# EAGLE design raspberry_pi_v007 (EAGLE 9.6.2)
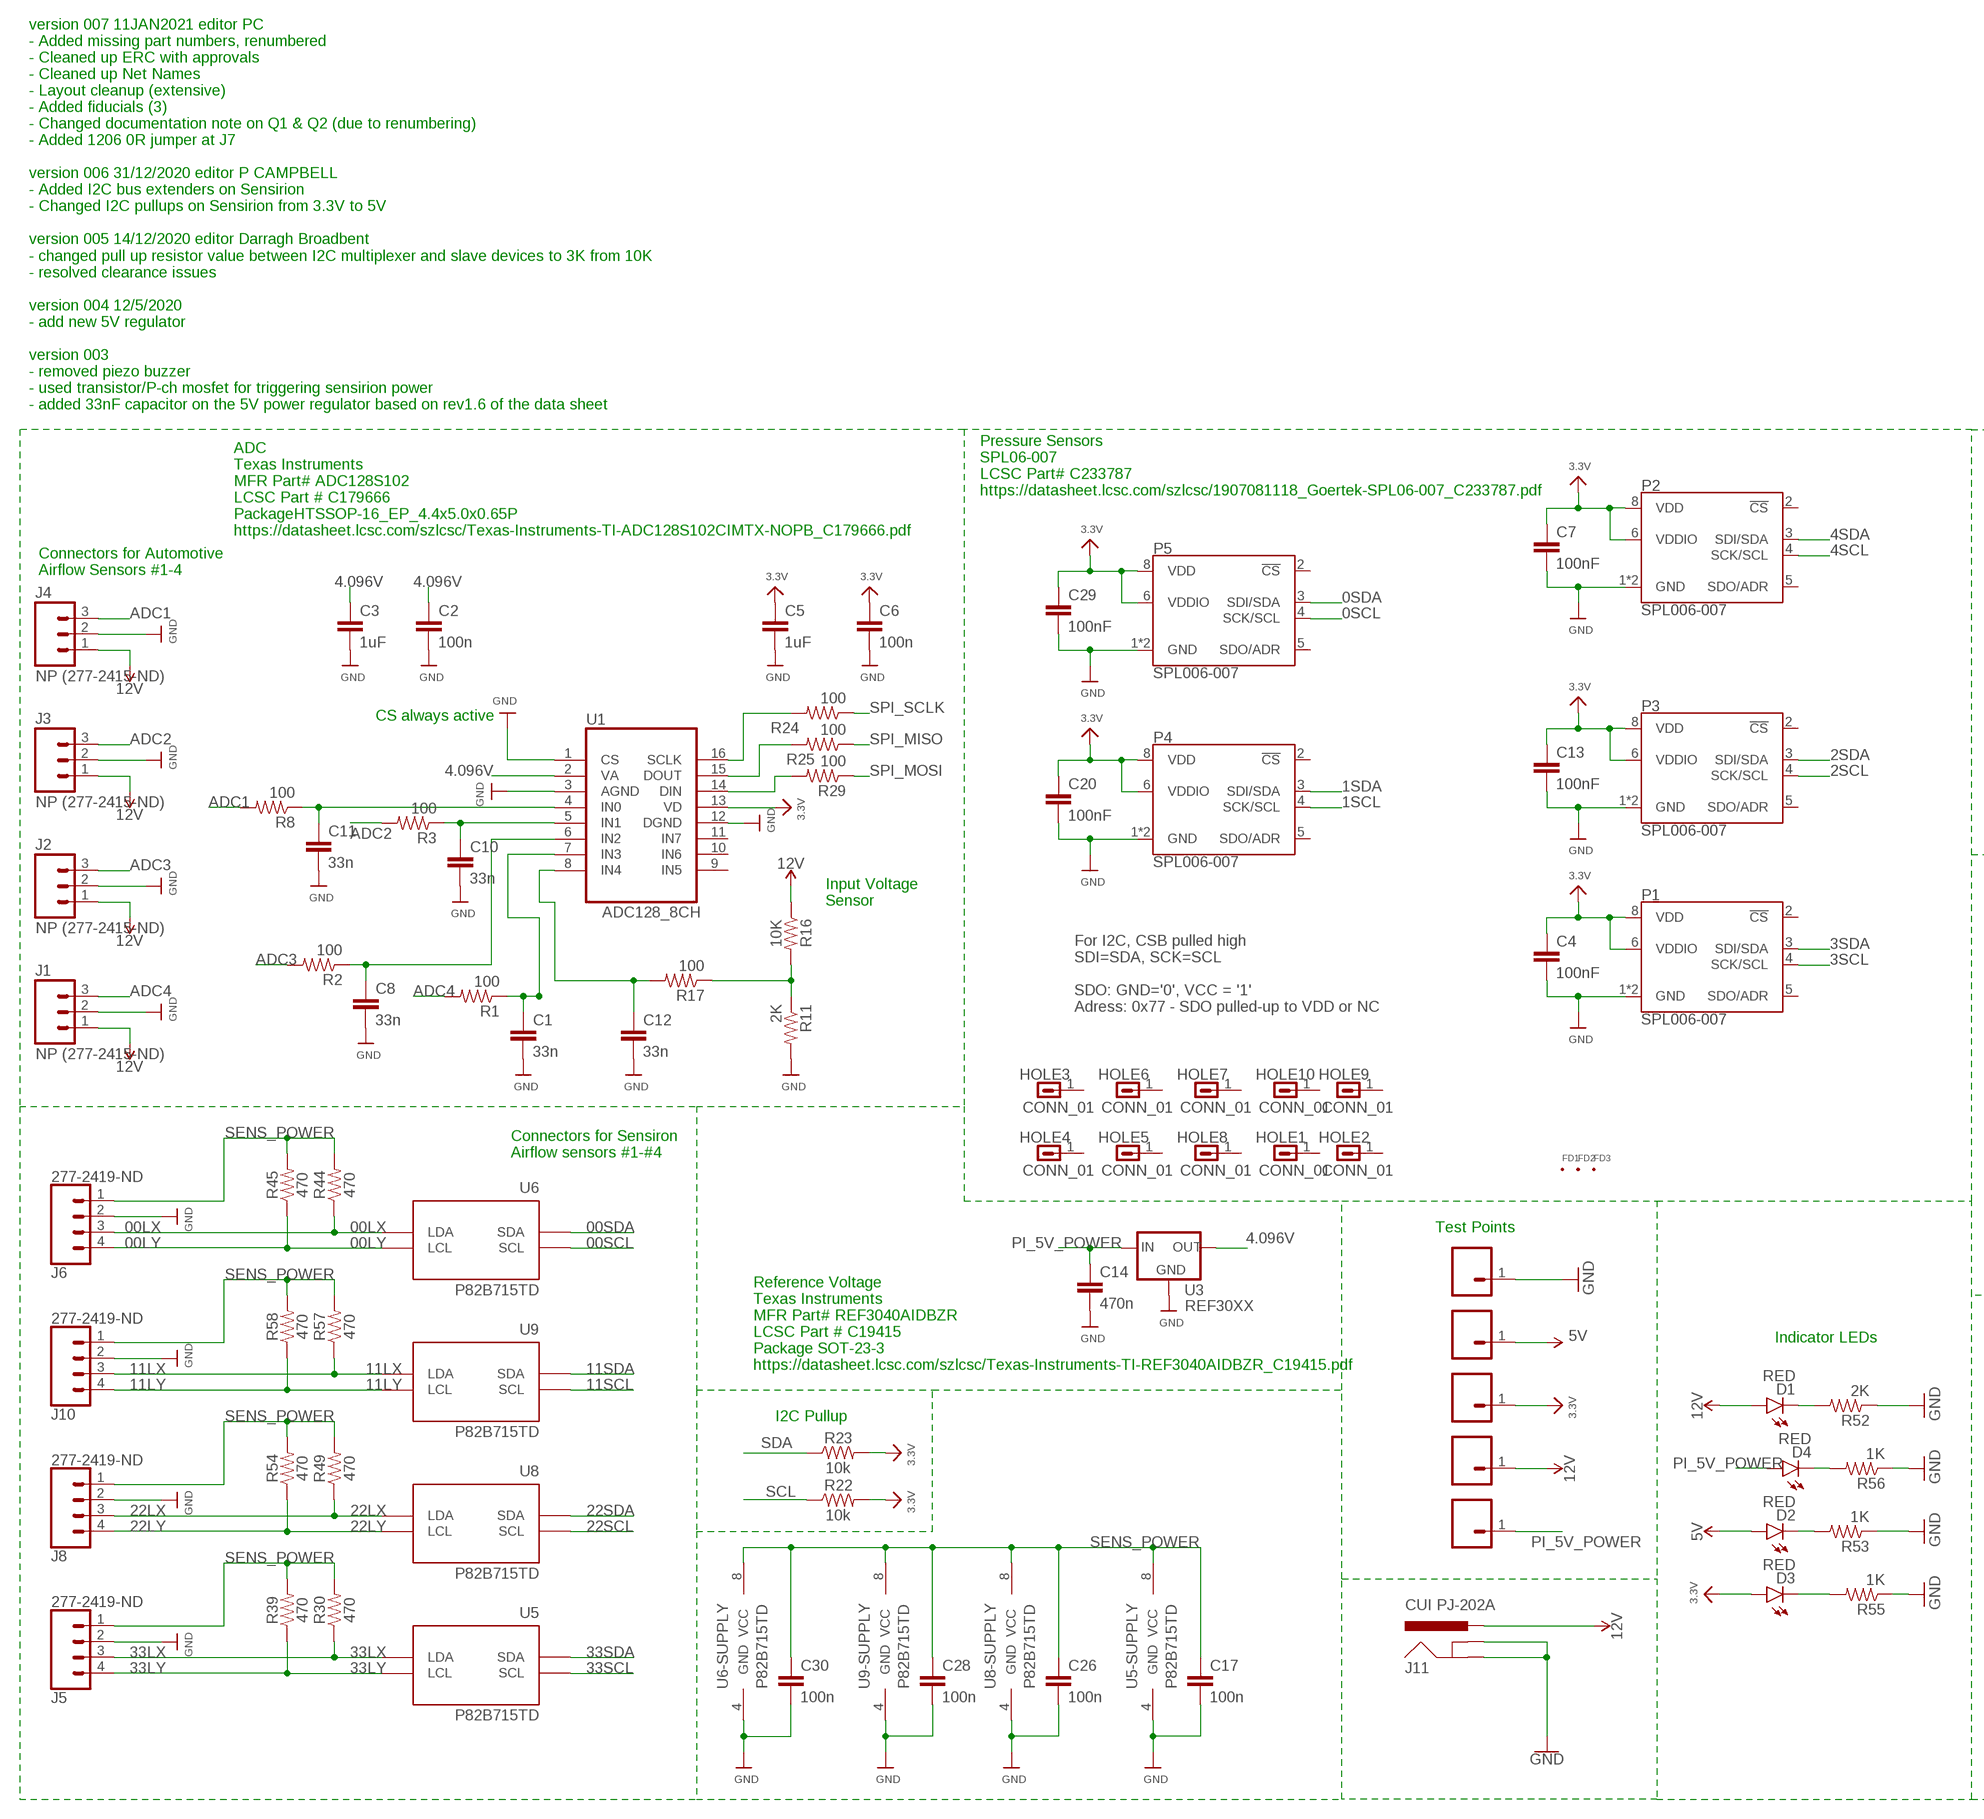
[diagram p0: schematic, sheet 1, part 1 of 2]
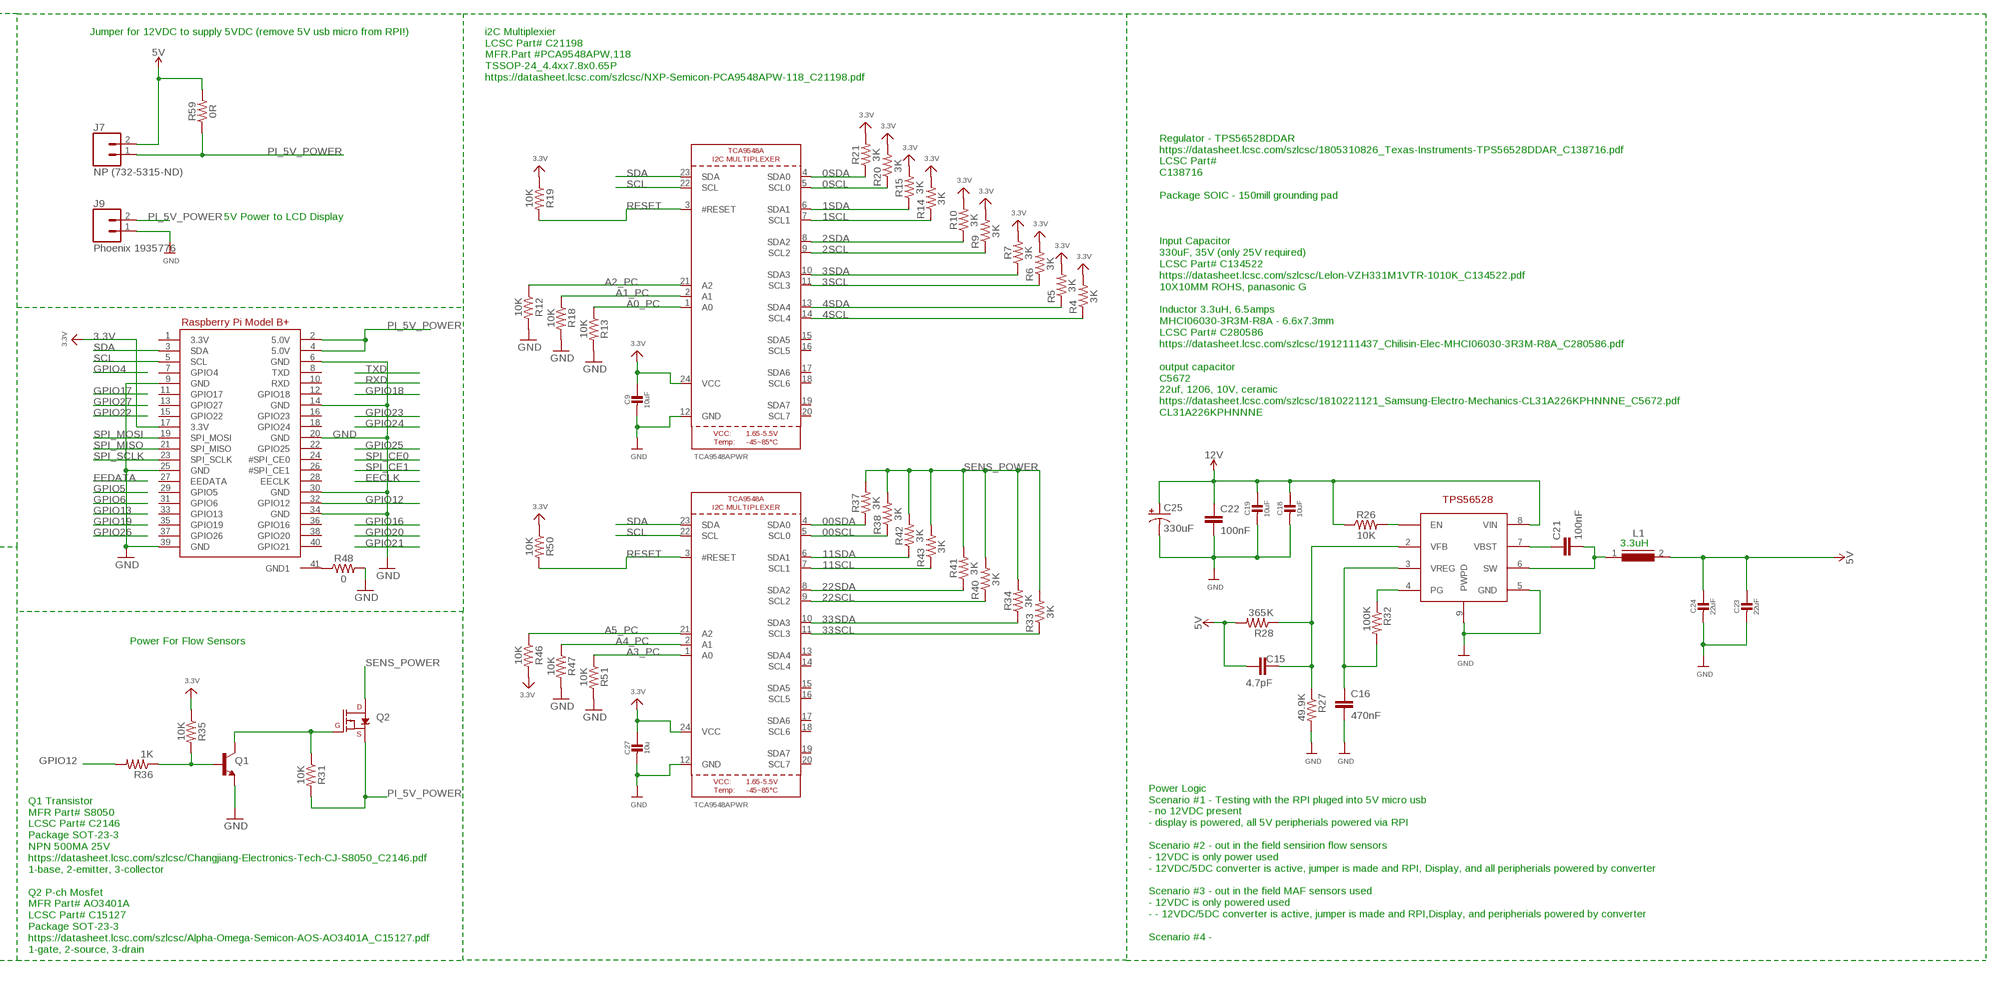
[diagram p1: schematic, sheet 1, part 2 of 2]

## Parts
C1  33n  CAP-0805  [0805]
C2  100n  CAP-0805  [0805]
C3  1uF  CAP-0805  [0805]
C4  100nF  CAP-0805  [0805]
C5  1uF  CAP-0805  [0805]
C6  100n  CAP-0805  [0805]
C7  100nF  CAP-0805  [0805]
C8  33n  CAP-0805  [0805]
C9  10uF  CAP_CERAMIC0805-NOOUTLINE  [0805-NO]
C10  33n  CAP-0805  [0805]
C11  33n  CAP-0805  [0805]
C12  33n  CAP-0805  [0805]
C13  100nF  CAP-0805  [0805]
C14  470n  CAP-0805  [0805]
C15  4.7pF  CAP-0603  [0603]
C16  470nF  CAP-0805  [0805]
C17  100n  CAP-0805  [0805]
C18  10uF  CAP_CERAMIC0805-NOOUTLINE  [0805-NO]
C19  10uF  CAP_CERAMIC0805-NOOUTLINE  [0805-NO]
C20  100nF  CAP-0805  [0805]
C21  100nF  CAP-0805  [0805]
C22  100nF  CAP-0805  [0805]
C23  22uF  CAP_CERAMIC_1206  [_1206]
C24  22uF  CAP_CERAMIC_1206  [_1206]
C25  330uF  560UF-PANASONIC_G-25V-20%  [PANASONIC_G]
C26  100n  CAP-0805  [0805]
C27  10u  CAP_CERAMIC0805-NOOUTLINE  [0805-NO]
C28  100n  CAP-0805  [0805]
C29  100nF  CAP-0805  [0805]
C30  100n  CAP-0805  [0805]
D1  RED  LED-RED1206  [LED-1206]
D2  RED  LED-RED1206  [LED-1206]
D3  RED  LED-RED1206  [LED-1206]
D4  RED  LED-RED1206  [LED-1206]
FD1  FID_40MIL  [FID_040]
FD2  FID_40MIL  [FID_040]
FD3  FID_40MIL  [FID_040]
HOLE1  CONN_01  [1X01-#6_MACHINE]
HOLE2  CONN_01  [1X01-#6_MACHINE]
HOLE3  CONN_01  [1X01-#6_MACHINE]
HOLE4  CONN_01  [1X01-#6_MACHINE]
HOLE5  CONN_01  [1X01-#6_MACHINE]
HOLE6  CONN_01  [1X01-#6_MACHINE]
HOLE7  CONN_01  [1X01-#6_MACHINE]
HOLE8  CONN_01  [1X01-#6_MACHINE]
HOLE9  CONN_01  [1X01-#6_MACHINE]
HOLE10  CONN_01  [1X01-#6_MACHINE]
J1  NP (277-2415-ND)  M03SCREW  [SCREWTERMINAL-3.5MM-3]
J2  NP (277-2415-ND)  M03SCREW  [SCREWTERMINAL-3.5MM-3]
J3  NP (277-2415-ND)  M03SCREW  [SCREWTERMINAL-3.5MM-3]
J4  NP (277-2415-ND)  M03SCREW  [SCREWTERMINAL-3.5MM-3]
J5  277-2419-ND  CONN_043.5MM_RA  [1X04_3.5MM_RA]
J6  277-2419-ND  CONN_043.5MM_RA  [1X04_3.5MM_RA]
J7  NP (732-5315-ND)  CONN_02  [1X02]
J8  277-2419-ND  CONN_043.5MM_RA  [1X04_3.5MM_RA]
J9  Phoenix 1935776  CONN_025MM  [SCREWTERMINAL-5MM-2]
J10  277-2419-ND  CONN_043.5MM_RA  [1X04_3.5MM_RA]
J11  CUI PJ-202A  POWER_JACK  [POWER_JACK_PTH]
L1  INDUCTOR_6.6_7.3  [INDUCTOR_6.6_7.3]
P1  SPL006-007  [LGA-8-2.5X2.0]
P2  SPL006-007  [LGA-8-2.5X2.0]
P3  SPL006-007  [LGA-8-2.5X2.0]
P4  SPL006-007  [LGA-8-2.5X2.0]
P5  SPL006-007  [LGA-8-2.5X2.0]
Q1  500mA/300V  TRANS_NPN-MMBTA42  [SOT23-3]
Q2  4.3A/20V/54mΩ  MOSFET_PCH-IRLML2244  [SOT23-3]
R1  100  RESISTOR0805-RES  [0805]
R2  100  RESISTOR0805-RES  [0805]
R3  100  RESISTOR0805-RES  [0805]
R4  3K  0.3OHM-0805-1/8W-1%  [0805]
R5  3K  0.3OHM-0805-1/8W-1%  [0805]
R6  3K  0.3OHM-0805-1/8W-1%  [0805]
R7  3K  0.3OHM-0805-1/8W-1%  [0805]
R8  100  RESISTOR0805-RES  [0805]
R9  3K  0.3OHM-0805-1/8W-1%  [0805]
R10  3K  0.3OHM-0805-1/8W-1%  [0805]
R11  2K  RESISTOR0805-RES  [0805]
R12  10K  0.3OHM-0805-1/8W-1%  [0805]
R13  10K  0.3OHM-0805-1/8W-1%  [0805]
R14  3K  0.3OHM-0805-1/8W-1%  [0805]
R15  3K  0.3OHM-0805-1/8W-1%  [0805]
R16  10K  0.3OHM-0805-1/8W-1%  [0805]
R17  100  RESISTOR0805-RES  [0805]
R18  10K  0.3OHM-0805-1/8W-1%  [0805]
R19  10K  0.3OHM-0805-1/8W-1%  [0805]
R20  3K  0.3OHM-0805-1/8W-1%  [0805]
R21  3K  0.3OHM-0805-1/8W-1%  [0805]
R22  10k  0.3OHM-0805-1/8W-1%  [0805]
R23  10k  0.3OHM-0805-1/8W-1%  [0805]
R24  100  RESISTOR0805-RES  [0805]
R25  100  RESISTOR0805-RES  [0805]
R26  10K  0.3OHM-0805-1/8W-1%  [0805]
R27  49.9K  RESISTOR0805-RES  [0805]
R28  365K  RESISTOR0805-RES  [0805]
R29  100  RESISTOR0805-RES  [0805]
R30  470  RESISTOR0805  [0805]
R31  10K  0.3OHM-0805-1/8W-1%  [0805]
R32  100K  RESISTOR0805-RES  [0805]
R33  3K  0.3OHM-0805-1/8W-1%  [0805]
R34  3K  0.3OHM-0805-1/8W-1%  [0805]
R35  10K  0.3OHM-0805-1/8W-1%  [0805]
R36  1K  RESISTOR0805-RES  [0805]
R37  3K  0.3OHM-0805-1/8W-1%  [0805]
R38  3K  0.3OHM-0805-1/8W-1%  [0805]
R39  470  RESISTOR0805  [0805]
R40  3K  0.3OHM-0805-1/8W-1%  [0805]
R41  3K  0.3OHM-0805-1/8W-1%  [0805]
R42  3K  0.3OHM-0805-1/8W-1%  [0805]
R43  3K  0.3OHM-0805-1/8W-1%  [0805]
R44  470  RESISTOR0805  [0805]
R45  470  RESISTOR0805  [0805]
R46  10K  0.3OHM-0805-1/8W-1%  [0805]
R47  10K  0.3OHM-0805-1/8W-1%  [0805]
R48  0  0.3OHM-0805-1/8W-1%  [0805]
R49  470  RESISTOR0805  [0805]
R50  10K  0.3OHM-0805-1/8W-1%  [0805]
R51  10K  0.3OHM-0805-1/8W-1%  [0805]
R52  2K  RESISTOR0805-RES  [0805]
R53  1K  RESISTOR0805-RES  [0805]
R54  470  RESISTOR0805  [0805]
R55  1K  RESISTOR0805-RES  [0805]
R56  1K  RESISTOR0805-RES  [0805]
R57  470  RESISTOR0805  [0805]
R58  470  RESISTOR0805  [0805]
R59  0R  RESISTOR1206  [1206]
RPI3B+  MICROBUILDER_RASPBERRYPI_BPLUS_HATSLOTS  [MICROBUILDER_PI_HAT_SLOTS]
TP1  CONN_0138MILL  [1X01-40MILL]
TP2  CONN_0138MILL  [1X01-40MILL]
TP3  CONN_0138MILL  [1X01-40MILL]
TP4  CONN_0138MILL  [1X01-40MILL]
TP5  CONN_0138MILL  [1X01-40MILL]
U1  ADC128_8CH  [TSSOP16]
U2  TCA9548APWR  TCA9548A  [TSSOP24]
U3  REF30XX  [SOT23-3]
U4  TPS56528  [SOIC8_POWER]
U5  P82B715TD  [SOIC-8]
U6  P82B715TD  [SOIC-8]
U7  TCA9548APWR  TCA9548A  [TSSOP24]
U8  P82B715TD  [SOIC-8]
U9  P82B715TD  [SOIC-8]

## Nets
00LX: J6.3 R44.1 U6.7(LDA)
00LY: J6.4 R45.1 U6.2(LCL)
0SCL: P5.4(SCK/SCL) R20.1 U2.5(SCL0)
00SCL: R38.1 U6.3(SCL) U7.5(SCL0)
0SDA: P5.3(SDI/SDA) R21.1 U2.4(SDA0)
00SDA: R37.1 U6.6(SDA) U7.4(SDA0)
1SCL: P4.4(SCK/SCL) R14.1 U2.7(SCL1)
1SDA: P4.3(SDI/SDA) R15.1 U2.6(SDA1)
2SCL: P3.4(SCK/SCL) R9.1 U2.9(SCL2)
2SDA: P3.3(SDI/SDA) R10.1 U2.8(SDA2)
3.3V: C4.1 C5.1 C6.1 C7.1 C9.1 C13.1 C20.1 C27.1 C29.1 D3.A P1.6(VDDIO) P1.8(VDD) P2.6(VDDIO) P2.8(VDD) P3.6(VDDIO) P3.8(VDD) P4.6(VDDIO) P4.8(VDD) P5.6(VDDIO) P5.8(VDD) R4.2 R5.2 R6.2 R7.2 R9.2 R10.2 R14.2 R15.2 R19.1 R20.2 R21.2 R22.2 R23.2 R35.1 R46.2 R50.1 RPI3B+.17(3.3V) TP4.1 U1.13(VD) U2.24(VCC) U7.24(VCC)
3.3V-LED-R: D3.C R55.2
3SCL: P1.4(SCK/SCL) R6.1 U2.11(SCL3)
3SDA: P1.3(SDI/SDA) R7.1 U2.10(SDA3)
4.096V: C2.1 C3.1 U1.2(VA) U3.2(OUT)
4SCL: P2.4(SCK/SCL) R4.1 U2.14(SCL4)
4SDA: P2.3(SDI/SDA) R5.1 U2.13(SDA4)
5V: C15.1 C23.1 C24.1 D2.A J7.2 L1.2 R28.2 R59.2 TP2.1
5V-LED-R: D2.C R53.2
5VREG-EN: R26.2 U4.1(EN)
5VREG-PG: R32.1 U4.4(PG)
5VREG-SW: C21.2 L1.1 U4.6(SW)
5VREG-VBST: C21.1 U4.7(VBST)
5VREG-VFB: C15.2 R27.1 R28.1 U4.2(VFB)
5VREG-VREG: C16.1 R32.2 U4.3(VREG)
11LX: J10.3 R57.1 U9.7(LDA)
11LY: J10.4 R58.1 U9.2(LCL)
11SCL: R43.1 U7.7(SCL1) U9.3(SCL)
11SDA: R42.1 U7.6(SDA1) U9.6(SDA)
12V: C18.1 C19.1 C22.1 C25.+ D1.A J1.1 J2.1 J3.1 J4.1 J11.PWR R16.1 R26.1 TP1.1 U4.8(VIN)
12V-LED-R: D1.C R52.2
22LX: J8.3 R49.1 U8.7(LDA)
22LY: J8.4 R54.1 U8.2(LCL)
22SCL: R40.1 U7.9(SCL2) U8.3(SCL)
22SDA: R41.1 U7.8(SDA2) U8.6(SDA)
33LX: J5.3 R30.1 U5.7(LDA)
33LY: J5.4 R39.1 U5.2(LCL)
33SCL: R33.1 U5.3(SCL) U7.11(SCL3)
33SDA: R34.1 U5.6(SDA) U7.10(SDA3)
A0_PC: R13.1 U2.1(A0)
A1_PC: R18.1 U2.2(A1)
A2_PC: R12.1 U2.21(A2)
A3_PC: R51.1 U7.1(A0)
A4_PC: R47.1 U7.2(A1)
A5_PC: R46.1 U7.21(A2)
ADC1: J4.3 R8.2
ADC2: J3.3 R3.2
ADC3: J2.3 R2.2
ADC4: J1.3 R1.2
ADC-12V-SENSE: R11.1 R16.2 R17.1
ADC-DIN: R29.2 U1.14(DIN)
ADC-DOUT: R25.2 U1.15(DOUT)
ADC-IN0: C11.1 R8.1 U1.4(IN0)
ADC-IN1: C10.1 R3.1 U1.5(IN1)
ADC-IN2: C8.1 R2.1 U1.6(IN2)
ADC-IN3: C1.1 R1.1 U1.7(IN3)
ADC-IN4: C12.1 R17.2 U1.8(IN4)
ADC-SCLK: R24.2 U1.16(SCLK)
GND: C1.2 C2.2 C3.2 C4.2 C5.2 C6.2 C7.2 C8.2 C9.2 C10.2 C11.2 C12.2 C13.2 C14.2 C16.2 C17.2 C18.2 C19.2 C20.2 C22.2 C23.2 C24.2 C25.- C26.2 C27.2 C28.2 C29.2 C30.2 J1.2 J2.2 J3.2 J4.2 J5.2 J6.2 J8.2 J9.1 J10.2 J11.GND J11.GNDBREAK P1.1(GND) P1.7(GND) P2.1(GND) P2.7(GND) P3.1(GND) P3.7(GND) P4.1(GND) P4.7(GND) P5.1(GND) P5.7(GND) Q1.2(E) R11.2 R12.2 R13.2 R18.2 R27.2 R47.2 R48.2 R51.2 R52.1 R53.1 R55.1 R56.1 RPI3B+.6(GND) RPI3B+.9(GND) RPI3B+.14(GND) RPI3B+.20(GND) RPI3B+.25(GND) RPI3B+.30(GND) RPI3B+.34(GND) RPI3B+.39(GND) TP3.1 U1.1(CS) U1.3(AGND) U1.12(DGND) U2.12(GND) U3.3(GND) U4.5(GND) U4.9(PWPD) U5.4(GND) U6.4(GND) U7.12(GND) U8.4(GND) U9.4(GND)
GND1: R48.1 RPI3B+.41(GND1)
GPIO12: R36.2 RPI3B+.32(GPIO12)
PI5V-LED-R: D4.C R56.2
PI_5V_POWER: C14.1 D4.A J7.1 J9.2 Q2.2(S) R31.2 R59.1 RPI3B+.2(5.0V) RPI3B+.4(5.0V) TP5.1 U3.1(IN)
RESET: R19.2 R50.2 U2.3(#RESET) U7.3(#RESET)
SCL: R22.1 RPI3B+.5(SCL) U2.22(SCL) U7.22(SCL)
SDA: R23.1 RPI3B+.3(SDA) U2.23(SDA) U7.23(SDA)
SENS_POWER: C17.1 C26.1 C28.1 C30.1 J5.1 J6.1 J8.1 J10.1 Q2.3(D) R30.2 R33.2 R34.2 R37.2 R38.2 R39.2 R40.2 R41.2 R42.2 R43.2 R44.2 R45.2 R49.2 R54.2 R57.2 R58.2 U5.8(VCC) U6.8(VCC) U8.8(VCC) U9.8(VCC)
SENS_POWER_BASE: Q1.1(B) R35.2 R36.1
SENS_POWER_GATE: Q1.3(C) Q2.1(G) R31.1
SPI_MISO: R25.1 RPI3B+.21(SPI_MISO)
SPI_MOSI: R29.1 RPI3B+.19(SPI_MOSI)
SPI_SCLK: R24.1 RPI3B+.23(SPI_SCLK)
Unconnected: HOLE1.1 HOLE2.1 HOLE3.1 HOLE4.1 HOLE5.1 HOLE6.1 HOLE7.1 HOLE8.1 HOLE9.1 HOLE10.1 P1.2(!CS) P1.5(SDO/ADR) P2.2(!CS) P2.5(SDO/ADR) P3.2(!CS) P3.5(SDO/ADR) P4.2(!CS) P4.5(SDO/ADR) P5.2(!CS) P5.5(SDO/ADR) RPI3B+.1(3.3V) RPI3B+.7(GPIO4) RPI3B+.8(TXD) RPI3B+.10(RXD) RPI3B+.11(GPIO17) RPI3B+.12(GPIO18) RPI3B+.13(GPIO27) RPI3B+.15(GPIO22) RPI3B+.16(GPIO23) RPI3B+.18(GPIO24) RPI3B+.22(GPIO25) RPI3B+.24(#SPI_CE0) RPI3B+.26(#SPI_CE1) RPI3B+.27(EEDATA) RPI3B+.28(EECLK) RPI3B+.29(GPIO5) RPI3B+.31(GPIO6) RPI3B+.33(GPIO13) RPI3B+.35(GPIO19) RPI3B+.36(GPIO16) RPI3B+.37(GPIO26) RPI3B+.38(GPIO20) RPI3B+.40(GPIO21) U1.9(IN5) U1.10(IN6) U1.11(IN7) U2.15(SDA5) U2.16(SCL5) U2.17(SDA6) U2.18(SCL6) U2.19(SDA7) U2.20(SCL7) U7.13(SDA4) U7.14(SCL4) U7.15(SDA5) U7.16(SCL5) U7.17(SDA6) U7.18(SCL6) U7.19(SDA7) U7.20(SCL7)

## Notes on the sheet
- version 007 11JAN2021 editor PC
  - Added missing part numbers, renumbered
  - Cleaned up ERC with approvals
  - Cleaned up Net Names
  - Layout cleanup (extensive)
  - Added fiducials (3)
  - Changed documentation note on Q1 & Q2 (due to renumbering)
  - Added 1206 0R jumper at J7
  
  version 006 31/12/2020 editor P CAMPBELL
  - Added I2C bus extenders on Sensirion
  - Changed I2C pullups on Sensirion from 3.3V to 5V
  
  version 005 14/12/2020 editor Darragh Broadbent
  - changed pull up resistor value between I2C multiplexer and slave devices to 3K from 10K
  - resolved clearance issues
  
  version 004 12/5/2020
  - add new 5V regulator
  
  version 003
  - removed piezo buzzer 
  - used transistor/P-ch mosfet for triggering sensirion power
  - added 33nF capacitor on the 5V power regulator based on rev1.6 of the data sheet
- ADC
  Texas Instruments
  MFR Part# ADC128S102
  LCSC Part # C179666
  PackageHTSSOP-16_EP_4.4x5.0x0.65P
  https://datasheet.lcsc.com/szlcsc/Texas-Instruments-TI-ADC128S102CIMTX-NOPB_C179666.pdf
- Jumper for 12VDC to supply 5VDC (remove 5V usb micro from RPI!)
- Pressure Sensors
  SPL06-007
  LCSC Part# C233787
  https://datasheet.lcsc.com/szlcsc/1907081118_Goertek-SPL06-007_C233787.pdf
- i2C Multiplexier
  LCSC Part# C21198
  MFR.Part #PCA9548APW,118
  TSSOP-24_4.4xx7.8x0.65P
  https://datasheet.lcsc.com/szlcsc/NXP-Semicon-PCA9548APW-118_C21198.pdf
- Connectors for Automotive 
  Airflow Sensors #1-4
- CS always active
- 5V Power to LCD Display
- Input Voltage 
  Sensor
- For I2C, CSB pulled high
  SDI=SDA, SCK=SCL
  
  SDO: GND='0', VCC = '1'
  Adress: 0x77 - SDO pulled-up to VDD or NC
- Regulator - TPS56528DDAR
  https://datasheet.lcsc.com/szlcsc/1805310826_Texas-Instruments-TPS56528DDAR_C138716.pdf
  LCSC Part# 
  C138716
  
  Package SOIC - 150mill grounding pad
  
  
  
  Input Capacitor
  330uF, 35V (only 25V required)
  LCSC Part# C134522
  https://datasheet.lcsc.com/szlcsc/Lelon-VZH331M1VTR-1010K_C134522.pdf
  10X10MM ROHS, panasonic G
  
  Inductor 3.3uH, 6.5amps
  MHCI06030-3R3M-R8A - 6.6x7.3mm
  LCSC Part# C280586
  https://datasheet.lcsc.com/szlcsc/1912111437_Chilisin-Elec-MHCI06030-3R3M-R8A_C280586.pdf
  
  output capacitor
  C5672
  22uf, 1206, 10V, ceramic
  https://datasheet.lcsc.com/szlcsc/1810221121_Samsung-Electro-Mechanics-CL31A226KPHNNNE_C5672.pdf
  CL31A226KPHNNNE
- Connectors for Sensiron
  Airflow sensors #1-#4
- 3.3uH
- Test Points
- Reference Voltage
  Texas Instruments
  MFR Part# REF3040AIDBZR
  LCSC Part # C19415
  Package SOT-23-3
  https://datasheet.lcsc.com/szlcsc/Texas-Instruments-TI-REF3040AIDBZR_C19415.pdf
- Indicator LEDs | Power For Flow Sensors
- I2C Pullup
- Q1 Transistor
  MFR Part# S8050
  LCSC Part# C2146
  Package SOT-23-3
  NPN 500MA 25V
  https://datasheet.lcsc.com/szlcsc/Changjiang-Electronics-Tech-CJ-S8050_C2146.pdf
  1-base, 2-emitter, 3-collector
  
  Q2 P-ch Mosfet
  MFR Part# AO3401A
  LCSC Part# C15127
  Package SOT-23-3
  https://datasheet.lcsc.com/szlcsc/Alpha-Omega-Semicon-AOS-AO3401A_C15127.pdf
  1-gate, 2-source, 3-drain
- Power Logic
  Scenario #1 - Testing with the RPI pluged into 5V micro usb
  - no 12VDC present
  - display is powered, all 5V peripherials powered via RPI
  
  Scenario #2 - out in the field sensirion flow sensors
  - 12VDC is only power used
  - 12VDC/5DC converter is active, jumper is made and RPI, Display, and all peripherials powered by converter
  
  Scenario #3 - out in the field MAF sensors used
  - 12VDC is only powered used
  - - 12VDC/5DC converter is active, jumper is made and RPI,Display, and peripherials powered by converter
  
  Scenario #4 -

## Library data of the parts
C1-C8 C10-C17 C20-C22 C26 C28-C30 = SparkFun-Capacitors:CAP
C9 C18 C19 C23 C24 C27 = microbuilder:CAP_CERAMIC: Ceramic Capacitors For new designs, use the packages preceded by an '_' character since they are more reliable: The following footprints should be used on most boards: _0402 - Standard footprint for regular board layouts _0603 - Standard footprint for regular board layouts _0805 - Standard footprint for regular board layouts _1206 - Standard footprint for regular board layouts For extremely tight-pitch boards where space is at a premium, the following 'micro-pitch' footprints can be used (smaller pads, no silkscreen outline, etc.): _0402MP - Micro-pitch footprint for very dense/compact boards _0603MP - Micro-pitch footprint for very dense/compact boards _0805MP - Micro-pitch footprint for very dense/compact boards _1206MP - Micro-pitch footprint for very dense/compact boards
C25 = SparkFun-Capacitors:560UF: 560µF polarized capacitors A capacitor is a passive two-terminal electrical component used to store electrical energy temporarily in an electric field.; PROD_ID: CAP-09983; VALUE: 560uF
D1-D4 = SparkFun-LED:LED-RED: Red SMD LED Used in manufacturing of most products at SparkFun Packages: 0603 - SMD 0603 package [Product Link] <http://docs.avagotech.com/docs/AV02-0551EN> 0603 SMART - SMD 0603 SMART package ( more efficient and expensive)[Product Link] <http://www.osram-os.com/Graphics/XPic2/00077099_0.pdf> 1206 - SMD1206 package [Product Link] <https://www.sparkfun.com/datasheets/DevTools/LilyPad/Q150OVS4.pdff> SparkFun Products: Pro Mini 328 -5V <https://www.sparkfun.com/products/821> RedBoard <https://www.sparkfun.com/products/12757> IOIO-OTG <https://www.sparkfun.com/products/13613>; PROD_ID: DIO-09912
FD1-FD3 = Fiducial:FID: Fiducial marks. Top and Bottom copper with stop mask
HOLE1-HOLE10 = th_libraries:CONN_01: #6 Machine Screw tite - 144mil hole, 256mil diameter
J1-J4 = SparkFun-Connectors:M03: Header 3 Standard 3-pin 0.1" header. Use with straight break away headers (SKU : PRT-00116), right angle break away headers (PRT-00553), swiss pins (PRT-00743), machine pins (PRT-00117), and female headers (PRT-00115). Molex polarized connector foot print use with SKU : PRT-08232 with associated crimp pins and housings.; PROD_ID: CONN-08288
J5 J6 J8 J10 = th_libraries:CONN_04: Multi connection point. Often used as Generic Header-pin footprint for 0.1 inch spaced/style header connections On any of the 0.1 inch spaced packages, you can populate with these: Break Away Headers - Straight <https://www.sparkfun.com/products/116> (PRT-00116) Break Away Male Headers - Right Angle <https://www.sparkfun.com/products/553> (PRT-00553) Female Headers <https://www.sparkfun.com/products/115> (PRT-00115) Break Away Headers - Machine Pin <https://www.sparkfun.com/products/117> (PRT-00117) Break Away Female Headers - Swiss Machine Pin <https://www.sparkfun.com/products/743> (PRT-00743) For SCREWTERMINALS and SPRING TERMINALS visit here: Screw Terimnals on SparkFun.com <https://www.sparkfun.com/search/results?term=Screw+Terminals> (5mm/3.5mm/2.54mm spacing) This device is also useful as a general connection point to wire up your design to another part of your project. Our various solder wires solder well into these plated through hole pads. Hook-Up Wire - Assortment (Stranded, 22 AWG) <https://www.sparkfun.com/products/11375> (PRT-11375) Hook-Up Wire - Assortment (Solid Core, 22 AWG) <https://www.sparkfun.com/products/11367> (PRT-11367) View the entire wire category on our website here <https://www.sparkfun.com/categories/141> Special notes: Molex polarized connector foot print use with SKU : PRT-08231 with associated crimp pins and housings. 1MM SMD Version SKU: PRT-10208
J7 = SparkFun-Connectors:CONN_02: Multi connection point. Often used as Generic Header-pin footprint for 0.1 inch spaced/style header connections On any of the 0.1 inch spaced packages, you can populate with these: Break Away Headers - Straight <https://www.sparkfun.com/products/116> (PRT-00116) Break Away Male Headers - Right Angle <https://www.sparkfun.com/products/553> (PRT-00553) Female Headers <https://www.sparkfun.com/products/115> (PRT-00115) Break Away Headers - Machine Pin <https://www.sparkfun.com/products/117> (PRT-00117) Break Away Female Headers - Swiss Machine Pin <https://www.sparkfun.com/products/743> (PRT-00743) For SCREWTERMINALS and SPRING TERMINALS visit here: Screw Terimnals on SparkFun.com <https://www.sparkfun.com/search/results?term=Screw+Terminals> (5mm/3.5mm/2.54mm spacing) This device is also useful as a general connection point to wire up your design to another part of your project. Our various solder wires solder well into these plated through hole pads. Hook-Up Wire - Assortment (Stranded, 22 AWG) <https://www.sparkfun.com/products/11375> (PRT-11375) Hook-Up Wire - Assortment (Solid Core, 22 AWG) <https://www.sparkfun.com/products/11367> (PRT-11367) View the entire wire category on our website here <https://www.sparkfun.com/categories/141> Special notes: Molex polarized connector foot print use with: PRT-08233 with associated crimp pins and housings. 2.54_SCREWTERM for use with PRT-10571. 3.5mm Screw Terminal footprints for PRT-08084 5mm Screw Terminal footprints for use with PRT-08432
J9 = SparkFun-Connectors:CONN_02: Multi connection point. Often used as Generic Header-pin footprint for 0.1 inch spaced/style header connections On any of the 0.1 inch spaced packages, you can populate with these: Break Away Headers - Straight <https://www.sparkfun.com/products/116> (PRT-00116) Break Away Male Headers - Right Angle <https://www.sparkfun.com/products/553> (PRT-00553) Female Headers <https://www.sparkfun.com/products/115> (PRT-00115) Break Away Headers - Machine Pin <https://www.sparkfun.com/products/117> (PRT-00117) Break Away Female Headers - Swiss Machine Pin <https://www.sparkfun.com/products/743> (PRT-00743) For SCREWTERMINALS and SPRING TERMINALS visit here: Screw Terimnals on SparkFun.com <https://www.sparkfun.com/search/results?term=Screw+Terminals> (5mm/3.5mm/2.54mm spacing) This device is also useful as a general connection point to wire up your design to another part of your project. Our various solder wires solder well into these plated through hole pads. Hook-Up Wire - Assortment (Stranded, 22 AWG) <https://www.sparkfun.com/products/11375> (PRT-11375) Hook-Up Wire - Assortment (Solid Core, 22 AWG) <https://www.sparkfun.com/products/11367> (PRT-11367) View the entire wire category on our website here <https://www.sparkfun.com/categories/141> Special notes: Molex polarized connector foot print use with: PRT-08233 with associated crimp pins and housings. 2.54_SCREWTERM for use with PRT-10571. 3.5mm Screw Terminal footprints for PRT-08084 5mm Screw Terminal footprints for use with PRT-08432; SF_SKU: PRT-08432
J11 = SparkFun-Connectors:POWER_JACK: Power Jack Connector This is the standard 5.5mm barrel jack for power. The PTH is the most common, proven, reliable, footprint. The Slot footprint only works if the mill layer is transmitted to the PCB fab house so be warned. Here are the connectors we sell at SparkFun: DC Barrel Power Jack/Connector <https://www.sparkfun.com/products/119> (PRT-00119) DC Barrel Power Jack/Connector (SMD) <https://www.sparkfun.com/products/12748> (PRT-12748) DC Barrel Jack Adapter - Breadboard Compatible <https://www.sparkfun.com/products/10811> (PRT-10811) It is used on this SparkFun product (and many, many others): SparkFun RedBoard - Programmed with Arduino <https://www.sparkfun.com/products/12757> (DEV-12757) Also, if you need a mating power supply or connector, please check these out: Wall Adapter Power Supply - 9VDC 650mA <https://www.sparkfun.com/products/298> (TOL-00298) DC Barrel Jack Adapter - Male <https://www.sparkfun.com/products/10287> (PRT-10287); PROD_ID: CONN-08197
L1 = th_libraries:INDUCTOR_6.6_7.3: https://datasheet.lcsc.com/szlcsc/1912111437_Chilisin-Elec-MHCI06030-3R3M-R8A_C280586.pdf 06030 6.6mm x 7.3mm
P1-P5 = th_libraries:SPL006-007: Goertek SPL06-007 – Combined Humidity and Pressure Sensor The SPL06-007 is as combined digital humidity, pressure and temperature sensor.. The sensor module is housed in an extremely compact metal-lid LGA package with a footprint of only 2.5×2.0mm² with a height of 0.95mm. . Datasheet <https://datasheet.lcsc.com/szlcsc/1907081118_Goertek-SPL06-007_C233787.pdf>
Q1 = SparkFun-DiscreteSemi:TRANS_NPN: NPN transistor Current controlled devices typically used to amplify current or used as a switch. BC547 - COM-08928 <http://www.sparkfun.com/products/8928> (TO-92 45V 100mA) (1.Collector 2.Base 3.Emitter) 2N3904 - COM-00521 <http://www.sparkfun.com/products/521> (TO-92 40V 200mA) (1.Emitter 2.Base 3.Collector) P2N2222A - COM-12852 <http://www.sparkfun.com/products/12852> (TO-92 40V 600mA) (1.Collector 2.Base 3.Emitter); PROD_ID: TRANS-09116
Q2 = SparkFun-DiscreteSemi:MOSFET_PCH: P-channel MOSFETs Voltage controlled devices that allow control of high current outputs. SparkFun Products: SparkFun ESP32 Thing <https://www.sparkfun.com/products/13907> SparkFun ESP8266 Thing <https://www.sparkfun.com/products/13231> SparkFun Pi Servo HAT V2 <https://www.sparkfun.com/products/15316> DMG2305UX-7 (20V/4.2A/SOT23-3); PROD_ID: TRANS-11153
R1-R3 R8 R11 R17 R24 R25 R27-R29 R32 R36 R52 R53 R55 R56 = SparkFun-Passives:RESISTOR: Resistor Basic schematic elements and footprints for 0603, 1206, and PTH resistors.
R4-R7 R9 R10 R12-R16 R18-R23 R26 R31 R33-R35 R37 R38 R40-R43 R46-R48 R50 R51 = SparkFun-Resistors:0.3OHM: 0.3Ω resistor A resistor is a passive two-terminal electrical component that implements electrical resistance as a circuit element. Resistors act to reduce current flow, and, at the same time, act to lower voltage levels within circuits. - Wikipedia; PROD_ID: RES-11622; VALUE: 0.3
R30 R39 R44 R45 R49 R54 R57-R59 = SparkFun-Resistors:RESISTOR: Generic Resistor Package
RPI3B+ = pi_hat_with_ground_pin:MICROBUILDER_RASPBERRYPI_BPLUS
TP1-TP5 = th_libraries3:CONN_01: #6 Machine Screw tite - 144mil hole, 256mil diameter
U1 = th_libraries:ADC128_8CH: ADC128S102 12-bit, 8 Channel ADC http://www.ti.com/lit/ds/symlink/adc128s102.pdf?HQS=TI-null-null-digikeymode-df-pf-null-wwe&ts=1591294747607 https://www.digikey.com/product-detail/en/texas-instruments/ADC128S102CIMTX-NOPB/296-41184-1-ND/5222639
U2 U7 = microbuilder:TCA9548A: TCA9548A I2C Multiplexer
U3 = th_libraries:REF30XX: Voltage Reference REF3012 - 1.25V REF3020 - 2.048V REF3025 - 2.5V REF3030 - 3.0V REF3033 - 3.3V REF3040 - 4.096V REF3040AIDBZR https://www.digikey.com/product-detail/en/texas-instruments/REF3040AIDBZR/296-35920-1-ND/4135041
U4 = th_libraries:TPS56528: TPS56528 https://datasheet.lcsc.com/szlcsc/1805310826_Texas-Instruments-TPS56528DDAR_C138716.pdf
U5 U6 U8 U9 = Volks73-NXPSemiconductors:P82B715?: I2C-Bus Extender I2C-bus extender Documentation Datasheet <http://www.nxp.com/documents/data_sheet/P82B715.pdf> General Description The P82B715 is a bipolar IC intended for application in I2C-bus and derivative bus systems. While retaining all the operating modes and features of the I2C-bus it permits extension of the practical separation distance between components on the I2C-bus by buffering both the data (SDA) and the clock (SCL) lines. The I2C-bus capacitance limit of 400 pF restricts practical communication distances to a few meters. Using one P82B715 at each end of a long cable (connecting Lx/Ly to Lx/Ly) reduces that cable’s loading on the linked I2C-buses by a factor of 10 and allows the total system capacitance load (all devices, cable, connectors, and traces or wires connected to the I2C-bus) to be around 3000 pF while the loading on each I2C-bus on the Sx/Sy sides remains below 400 pF. Longer cables or low-cost, general-purpose wiring may be used to link I2C-bus based modules without degrading noise margins. Multiple P82B715s can be connected together, linking their Lx/Ly ports, in a star or multi-point architecture as long as the total capacitance of the system is less than about 3000 pF and each bus at an Sx/Sy connection is well below 400 pF. This configuration, with the master and/or slave devices attached to the Sx/Sy port of each P82B715, has full multi-master communication capability. The P82B715 alone does not support voltage level translation, but it can be simply implemented using low cost transistors when required. There is no restriction on interconnecting the Sx/Sy I/Os, and, because the device output levels are always held within 100 mV of input drive levels, P82B715 is compatible with bus buffers that use voltage level offsets, e.g., PCA9511A, PCA9517, Sx/Sy side of P82B96. The lower VOL level and ability to operate with any master, slave or bus buffer is the primary advantage of the using the P82B715 for long distance buses at the disadvantage of not isolating bus capacitance like the P82B96 or PCA9600 are able to do. The primary disadvantage of the P82B96 and PCA9600 is that the static level offset needed to isolate bus capacitance does not allow these devices to operate with other bus buffers with special offset levels or with master/slaves that require a VIL lower than 0.8 V with noise margin. A proven quick design-in point-to-point/multi-point circuit (Figure 9) is included in Section 8.2 to allow rapid use of the P82B715 along with comparison waveforms so that the designer can clearly see the trade-offs between the P82B715 and the P82B96/PCA9600 and choose the type of device that is best for their application. Features Dual, bidirectional, unity voltage gain buffer with no external directional control required Compatible with I2C-bus and its derivatives SMBus, PMBus, DDC, etc. Logic signal levels may include (but not exceed) both supply and ground Logic signal input voltage levels are output without change and are independent of VCC ×10 impedance transformation, but does not change logic voltage levels Supply voltage range 3 V to 12 V Clock speeds to at least 100 kHz and 400 kHz when other system delays permit ESD protection exceeds 2500 V HBM per Mil. Std 883C-3015.7 and 400 V MM per JESD22-A115 (I/Os have diodes to VCC and GND) Latch-up testing is done to JEDEC Standard JESD78 which exceeds 100 mA Applications Increase the total connected capacitance of an I2C-bus system to around 3000 pF Drive I2C-bus signals over long cables to approximately 50 meters or 3000 pF Drives ×10 lower impedance bus wiring for improved noise immunity Multi-drop distribution of I2C-bus signals using low cost twisted-pair cables AdvancedTCA radial IPMB architecture Driving 30 mA Fm+ devices from standard 3 mA parts; APPLICATIONS: I2C; CAPACITANCE-INPUT: 3000pF; CURRENT_SUPPLY: 22mA; DATA_RATE: 400kHz; DELAY_TIME: -; DESCRIPTION: IC REDRIVER I2C 1CH 400KHZ 8SO; DOCUMENTATION_LINK: <a href="http://www.nxp.com/documents/data_sheet/P82B715.pdf">Datasheet</a>; DOCUMENTATION_URL: http://www.nxp.com/documents/data_sheet/P82B715.pdf; INPUT: 2-Wire Buse; MANUFACTURER: NXP Semiconductors; NUMBER_OF_CHANNELS: 1; OPERATING_TEMPERATURE: -40C ~ 85C; OUTPUT: 2-Wire Bus; PART_NUMBER: P82B715TD,118; SIGNAL_CONDITIONING: -; SUPPLIER_ITEM_LINK: <a href="http://www.digikey.com/product-detail/en/P82B715TD,118/568-1007-2-ND/735621">Details</a>; SUPPLIER_ITEM_NUMBER: 568-1007-2-ND; SUPPLIER_ITEM_URL: http://www.digikey.com/product-detail/en/P82B715TD,118/568-1007-2-ND/735621; SUPPLIER_LINK: <a href="http://www.digikey.com">Home Page</a>; SUPPLIER_NAME: Digi-Key; SUPPLIER_URL: http://www.digikey.com; TYPE: Buffer, ReDriver; VOLTAGE_SUPPLY: 4.5V ~ 12V

## Net classes
1 highpower: width 0.305 mm, drill 0.483 mm
2 lowpower: width 0.305 mm, drill 0.483 mm

## Board
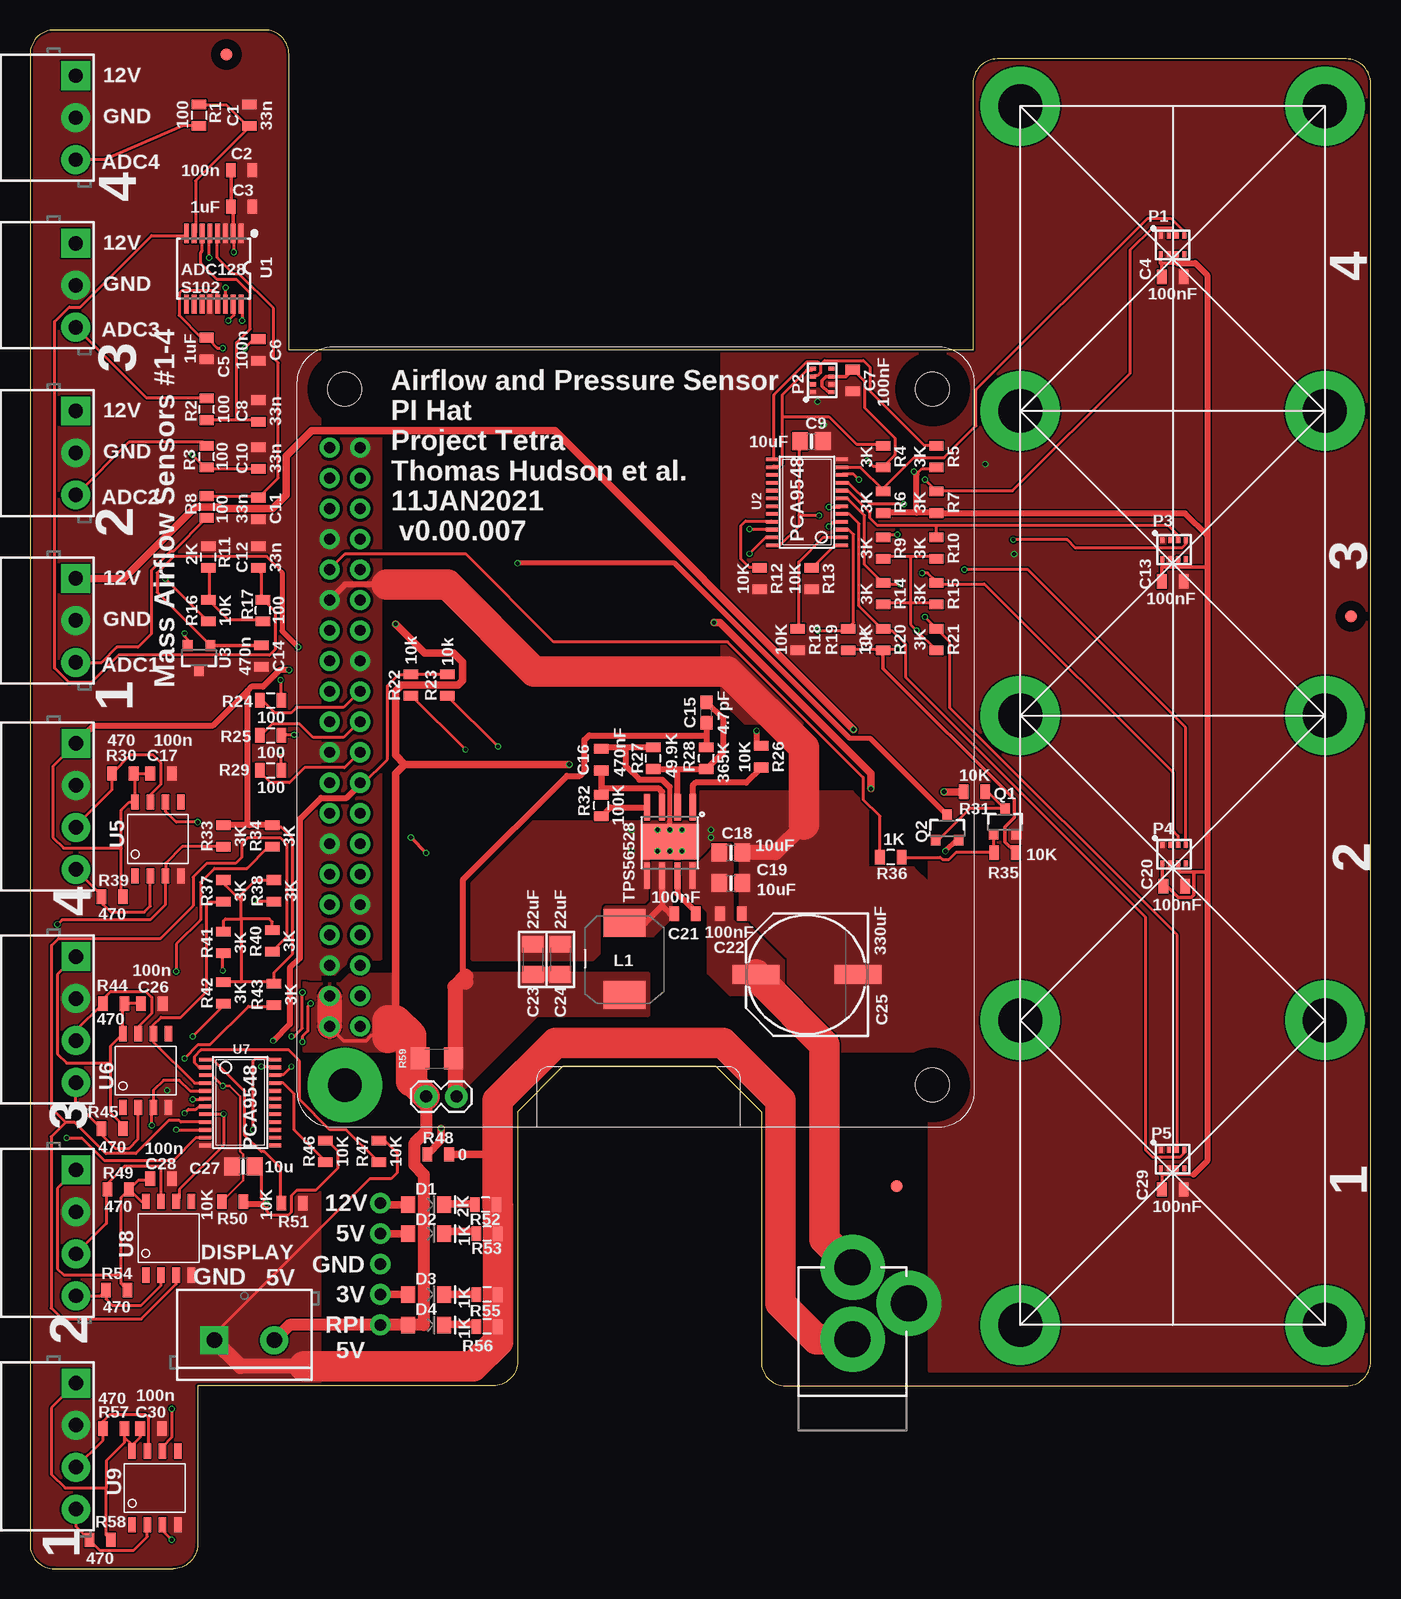
[diagram p2: board, top side]
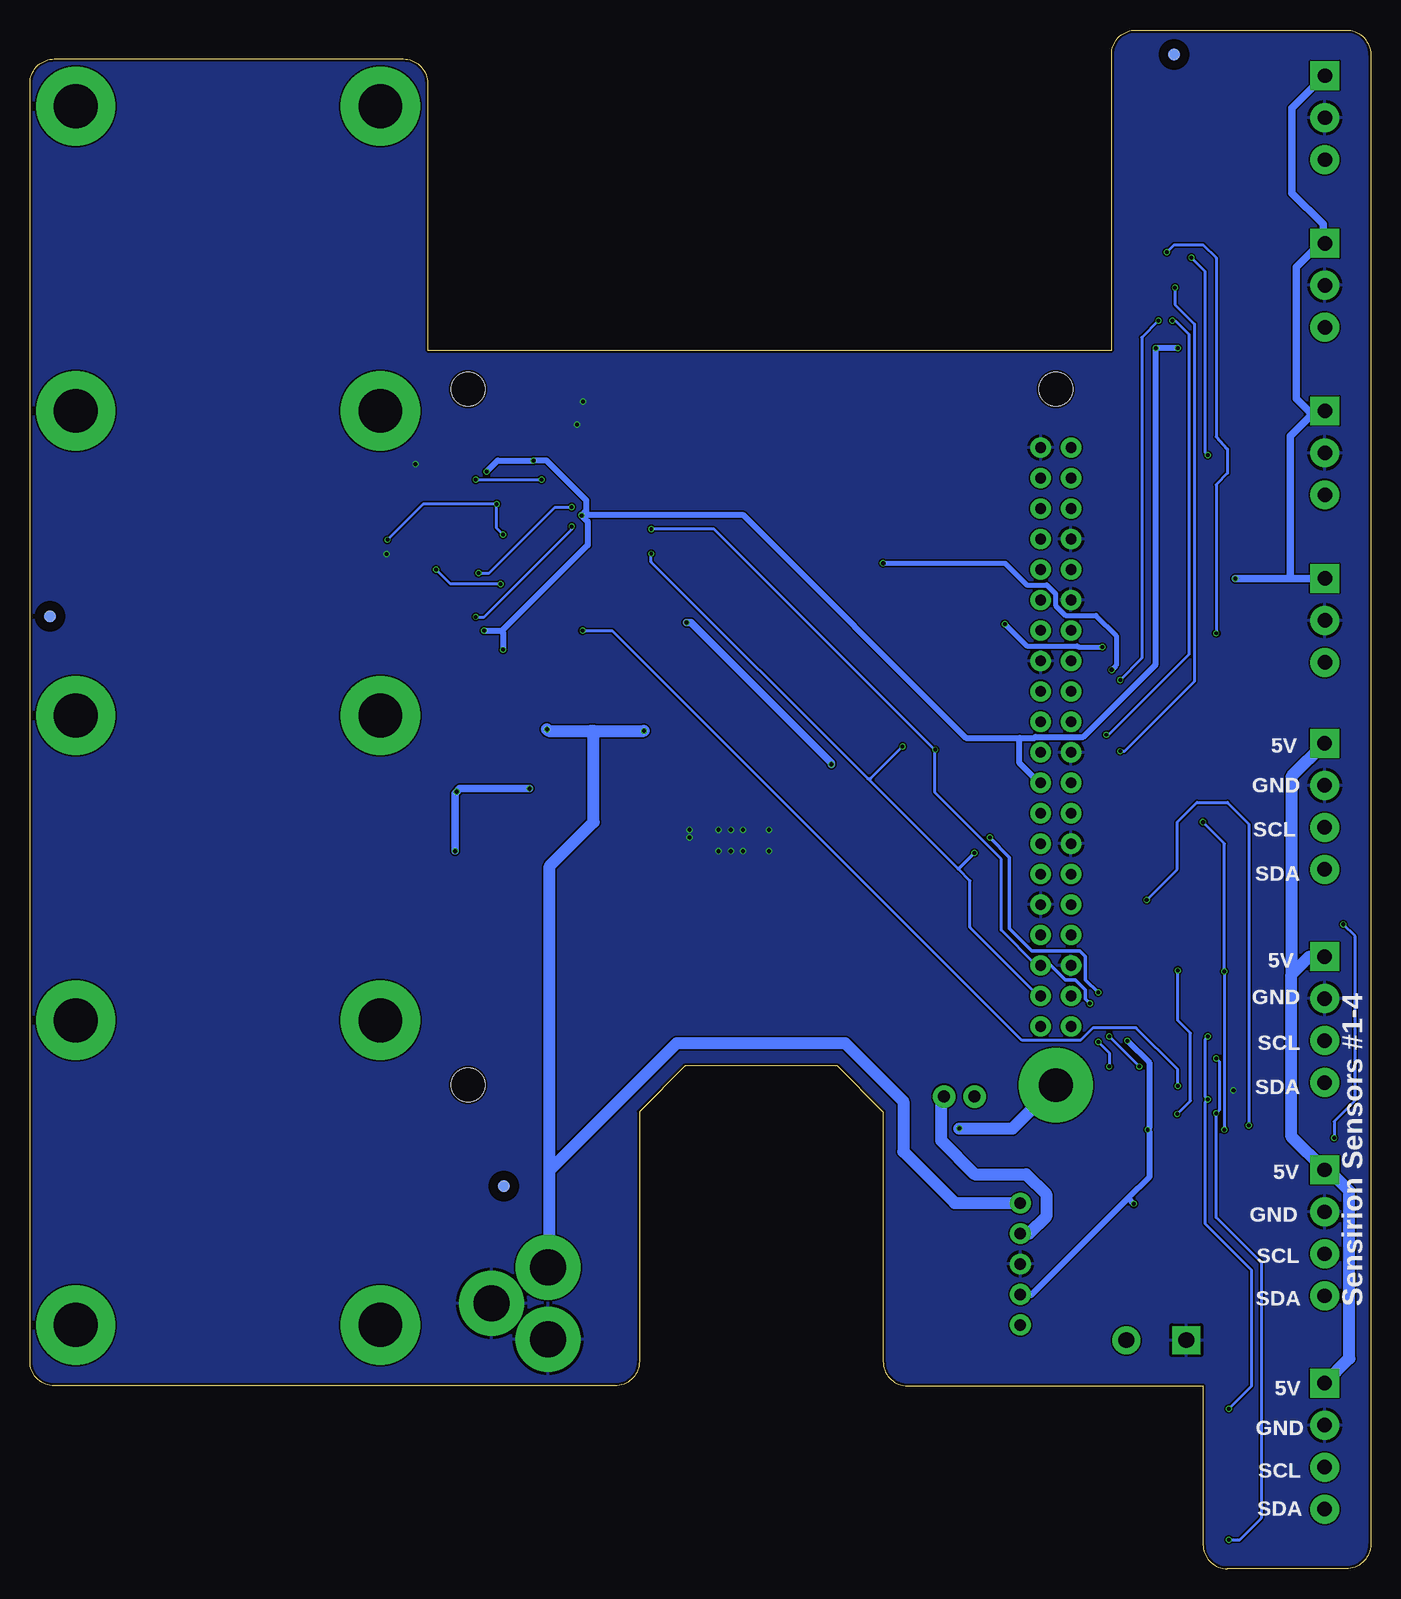
[diagram p3: board, bottom side, seen from below]

Size 111.76 x 128.27 mm. Coordinates in mm from the lower left corner, seen from the top.
Outline: 40.64,38.1 44.45,41.91 57.15,41.91 60.96,38.1 60.96,17.27 arc90 62.99,15.24 109.73,15.24 arc90 111.76,17.27 111.76,123.83 arc90 109.73,125.86 80.64,125.86 arc90 78.61,123.83 78.61,101.6 21.59,101.6 21.59,126.24 arc90 19.56,128.27 2.03,128.27 arc90 0,126.24 0,2.03 arc90 2.03,0 11.94,0 arc90 13.97,2.03 13.97,15.24 38.61,15.24 arc90 40.64,17.27 40.64,38.1
Copper layers (1*16): Top 0.035mm / dielectric 1.6mm / Bottom 0.035mm
Design rules "jlcpcb-2layers": minimum track width 5mil, minimum drill 0.3mm, track to track 5mil, track to pad 5mil, pad to pad 5mil, via to via 5mil, smd to smd 5mil, copper to edge 0.2mm, drill to drill 6mil, minimum pad ring 10mil, minimum via ring 3mil, stop-mask expansion 4mil, vias tented up to drill 0mil, thermal gap 10mil

### Footprints (pad centres in the part's own frame; a part is rotated, then mirrored left to right if it is on the bottom)
0805 = smd 0.8 x 1.2: 1 -0.9,0; 2 0.9,0
0805-NO = smd 1.3 x 1.5: 1 -0.95,0; 2 0.95,0
0603 = smd 1.1 x 1: 1 -0.85,0; 2 0.85,0
_1206 = smd 1.4 x 1.8: 1 -1.27,0; 2 1.27,0
PANASONIC_G = smd 3.9 x 1.6: + 4.25,0; - -4.25,0
LED-1206 = smd 1.2 x 1.4: A -1.5,0; C 1.5,0
FID_040 = smd 1.016 x 1.016 bottom: FIDB 0,0 | smd 1.016 x 1.016: FIDT 0,0
1X01-#6_MACHINE = drill 3.658 pad 6.604: 1 0,0
SCREWTERMINAL-3.5MM-3 = drill 1.2 pad 2.413 square: 1 0,0 | drill 1.2 pad 2.413: 2 3.5,0; 3 7,0
1X04_3.5MM_RA = drill 1.2 pad 2.413 square: 1 -0.228,0.023 | drill 1.2 pad 2.413: 2 3.272,0.023; 3 6.772,0.023; 4 10.272,0.023
1X02 = drill 1.016 pad 1.88: 1 0,0; 2 2.54,0
SCREWTERMINAL-5MM-2 = drill 1.3 pad 2.032 square: 1 0,0 | drill 1.3 pad 2.032: 2 5,0
POWER_JACK_PTH = drill 2.997 pad 4.318: GND 0,7.7; GNDBREAK 4.7,10.7; PWR 0,13.7
INDUCTOR_6.6_7.3 = smd 2.35 x 3.5: 1 -3.025,0.02; 2 2.975,0.02
LGA-8-2.5X2.0 = smd 0.5 x 0.35: 1 0.771,0.975; 2 0.771,0.325; 3 0.771,-0.325; 4 0.771,-0.975; 5 -0.779,-0.975; 6 -0.779,-0.325; 7 -0.779,0.325; 8 -0.779,0.975
SOT23-3 = smd 0.8 x 0.9: 1 -0.95,-1; 2 0.95,-1; 3 0,1.1
1206 = smd 1.6 x 1.8: 1 -1.4,0; 2 1.4,0
MICROBUILDER_PI_HAT_SLOTS = drill 0.9 pad 1.676: 1 8.37,51.23; 2 8.37,53.77; 3 10.91,51.23; 4 10.91,53.77; 5 13.45,51.23; 6 13.45,53.77; 7 15.99,51.23; 8 15.99,53.77; 9 18.53,51.23; 10 18.53,53.77; 11 21.07,51.23; 12 21.07,53.77; 13 23.61,51.23; 14 23.61,53.77; 15 26.15,51.23; 16 26.15,53.77; 17 28.69,51.23; 18 28.69,53.77; 19 31.23,51.23; 20 31.23,53.77; 21 33.77,51.23; 22 33.77,53.77; 23 36.31,51.23; 24 36.31,53.77; 25 38.85,51.23; 26 38.85,53.77; 27 41.39,51.23; 28 41.39,53.77; 29 43.93,51.23; 30 43.93,53.77; 31 46.47,51.23; 32 46.47,53.77; 33 49.01,51.23; 34 49.01,53.77; 35 51.55,51.23; 36 51.55,53.77; 37 54.09,51.23; 38 54.09,53.77; 39 56.63,51.23; 40 56.63,53.77 | drill 2.8 pad 6.198: 41 3.48,52.502 | hole 2.8: 3.5,3.5; 61.5,52.5; 61.5,3.5
1X01-40MILL = drill 0.965 pad 1.397: 1 0,0
TSSOP16 = smd 0.4 x 1.6: 1 -2.225,-2.85; 2 -1.575,-2.85; 3 -0.925,-2.85; 4 -0.275,-2.85; 5 0.375,-2.85; 6 1.025,-2.85; 7 1.675,-2.85; 8 2.325,-2.85; 9 2.325,3.05; 10 1.675,3.05; 11 1.025,3.05; 12 0.375,3.05; 13 -0.275,3.05; 14 -0.925,3.05; 15 -1.575,3.05; 16 -2.225,3.05
TSSOP24 = smd 0.305 x 0.991: 1 -3.575,-2.918; 2 -2.925,-2.918; 3 -2.275,-2.918; 4 -1.625,-2.918; 5 -0.975,-2.918; 6 -0.325,-2.918; 7 0.325,-2.918; 8 0.975,-2.918; 9 1.625,-2.918; 10 2.275,-2.918; 11 2.925,-2.918; 12 3.575,-2.918; 13 3.575,2.918; 14 2.925,2.918; 15 2.275,2.918; 16 1.625,2.918; 17 0.975,2.918; 18 0.325,2.918; 19 -0.325,2.918; 20 -0.975,2.918; 21 -1.625,2.918; 22 -2.275,2.918; 23 -2.925,2.918; 24 -3.575,2.918
SOIC8_POWER = smd 0.533 x 2.2: 1 -1.905,-2.515 | smd 0.61 x 2.21: 2 -0.635,-2.515 | smd 0.498 x 2.2: 3 0.635,-2.515; 4 1.905,-2.515; 5 1.905,3.2; 6 0.635,3.2; 7 -0.635,3.2; 8 -1.905,3.2 | smd 4.902 x 2.946: 9 0,0.356
SOIC-8 = smd 1.27 x 0.635: 1 -3.073,1.905; 2 -3.073,0.635; 3 -3.073,-0.635; 4 -3.073,-1.905; 5 3.073,-1.905; 6 3.073,-0.635; 7 3.073,0.635; 8 3.073,1.905

### Placement (x,y rotation side)
C1  18.29,121.16 90 top
C2  17.65,116.59 0 top
C3  17.65,113.54 0 top
C4  95.25,107.7 0 top
C5  14.73,101.73 270 top
C6  19.05,101.6 270 top
C7  68.58,99.06 270 top
C8  19.05,96.52 90 top
C9  65.15,93.98 0 top
C10  19.05,92.58 90 top
C11  19.05,88.39 270 top
C12  19.05,84.33 90 top
C13  95.25,82.3 0 top
C14  19.3,76.07 270 top
C15  56.39,71.37 90 top
C16  47.62,67.44 90 top
C17  10.92,66.29 0 top
C18  58.42,59.69 0 top
C19  58.42,57.15 0 top
C20  95.38,56.9 0 top
C21  54.61,54.61 180 top
C22  58.42,54.61 0 top
C23  41.91,50.8 90 top
C24  44.2,50.8 90 top
C25  64.77,49.53 180 top
C26  10.16,47.12 0 top
C27  17.78,33.53 180 top
C28  10.92,32.51 0 top
C29  95.25,31.62 0 top
C30  10.08,11.68 0 top
D1  33.02,30.35 0 top
D2  33.02,27.94 0 top
D3  33.02,22.86 0 top
D4  33.02,20.32 0 top
FD1  72.26,31.88 0 top
FD2  110.11,79.38 0 top
FD3  16.38,126.24 0 top
HOLE1  82.55,121.92 90 top
HOLE2  107.95,121.92 90 top
HOLE3  82.55,96.52 90 top
HOLE4  107.95,96.52 90 top
HOLE5  82.55,71.12 90 top
HOLE6  107.95,71.12 90 top
HOLE7  82.55,45.72 90 top
HOLE8  107.95,45.72 90 top
HOLE9  82.55,20.32 90 top
HOLE10  107.95,20.32 90 top
J1  3.81,124.46 270 top
J2  3.81,110.49 270 top
J3  3.81,96.52 270 top
J4  3.81,82.55 270 top
J5  3.81,68.58 270 top
J6  3.81,50.8 270 top
J7  33.02,39.37 0 top
J8  3.81,33.02 270 top
J9  15.37,19.05 0 top
J10  3.81,15.24 270 top
J11  68.58,11.43 0 top
L1  49.53,50.8 270 top
P1  95.25,110.36 90 top
P2  66.04,99.06 180 top
P3  95.38,84.96 90 top
P4  95.38,59.56 90 top
P5  95.25,34.16 90 top
Q1  81.28,62.23 0 top
Q2  76.45,61.72 0 top
R1  14.1,121.16 270 top
R2  14.73,96.65 90 top
R3  14.73,92.71 90 top
R4  71.12,92.71 270 top
R5  75.56,92.71 270 top
R6  71.12,88.9 270 top
R7  75.56,88.9 270 top
R8  14.73,88.52 270 top
R9  71.12,85.09 270 top
R10  75.56,85.09 270 top
R11  14.86,84.33 90 top
R12  60.83,82.55 270 top
R13  65.15,82.55 270 top
R14  71.12,81.28 270 top
R15  75.56,81.28 270 top
R16  14.86,79.88 90 top
R17  19.43,79.88 90 top
R18  64.01,77.47 270 top
R19  68.2,77.47 90 top
R20  71.12,77.47 270 top
R21  75.56,77.47 270 top
R22  31.75,73.66 90 top
R23  34.8,73.66 90 top
R24  20.07,72.39 0 top
R25  20.07,69.47 0 top
R26  60.96,67.69 270 top
R27  51.94,67.56 90 top
R28  56.39,67.56 90 top
R29  20.07,66.55 0 top
R30  7.75,66.29 0 top
R31  78.74,64.77 180 top
R32  47.62,63.63 90 top
R33  16.13,61.09 90 top
R34  20.19,61.09 90 top
R35  81.28,59.69 180 top
R36  71.75,59.31 180 top
R37  16.13,56.52 90 top
R38  20.32,56.52 90 top
R39  6.86,56.01 0 top
R40  20.19,52.32 90 top
R41  16.13,52.2 90 top
R42  16.13,48.01 90 top
R43  20.32,47.88 90 top
R44  6.98,47.12 0 top
R45  6.86,36.7 0 top
R46  24.64,34.8 90 top
R47  29.08,34.8 90 top
R48  34.04,34.54 0 top
R49  7.37,31.62 0 top
R50  16.89,30.61 180 top
R51  21.84,30.48 0 top
R52  37.97,30.35 180 top
R53  38.1,27.94 180 top
R54  7.24,23.24 0 top
R55  38.1,22.86 180 top
R56  38.1,20.19 180 top
R57  6.98,11.68 0 top
R58  5.84,2.41 0 top
R59  33.91,42.55 0 top
RPI3B+  78.74,36.83 90 top
TP1  29.21,30.48 90 top
TP2  29.21,27.94 180 top
TP3  29.21,25.4 90 top
TP4  29.21,22.86 90 top
TP5  29.21,20.32 0 top
U1  15.37,108.46 180 top
U2  64.77,88.9 90 top
U3  14.1,75.95 180 top
U4  53.34,60.96 180 top
U5  10.67,60.83 90 top
U6  9.65,41.53 90 top
U7  17.53,38.86 270 top
U8  11.56,27.56 90 top
U9  10.41,6.73 90 top

### Tracks (layer width: path | path; a pad name or v marks a point on that pad's centre or on a via)
00LX
  Top 0.254: J6.3 3.83,44.87 R44.1 6.09,47.49 6.73,48.13 9.65,48.13 10.16,47.62 10.16,46.3 9.02,45.15 U6.7
00LY
  Top 0.254: J6.4 3.83,38.83 R45.1 5.96,36.2 7.1,35.05 8.25,35.05 9.02,35.81 U6.2
0SCL
  Top 0.254: P5.4 96.23,34.68 95.84,34.3 93.59,34.3 93.02,34.87 93.02,54.31 73,74.32 73,77.06 71.86,78.21 71.17,78.21 R20.1 70.94,78.44 69.11,80.26 69.11,87.12 68.3,87.94 67.7,87.94 U2.5
00SCL  (via drill 0.35)
  Top 0.254: R38.1 18.81,55.62 v18.67,55.75 | v10.16,36.96 10.16,38.33 U6.3 10.29,39.88 11.14,40.73 12.45,40.73 13.34,39.84 U7.5
  Bottom 0.254: v18.67,55.75 16.13,58.29 16.13,62.23 14.48,63.88 11.94,63.88 10.16,62.1 v10.16,36.96
0SDA  (via drill 0.33)
  Top 0.254: P5.3 95.63,35 95.63,52.83 76.66,71.81 76.66,77.29 75.74,78.21 R21.1 75.51,78.44 v74.6,79.35 | U2.4 67.64,87.22 66.93,87.22 v66.6,86.89
  Bottom 0.254: v66.6,86.89 66.6,86.64 73.89,79.35 v74.6,79.35
00SDA
  Top 0.254: U7.4 13.71,40.49 10.29,43.92 U6.6 10.29,45.34 10.92,45.97 12.57,45.97 14.73,48.13 14.73,55.37 14.94,55.58 16.08,55.58 R37.1
1SCL  (via drill 0.33)
  Top 0.254: v72.54,82.09 71.17,82.09 R14.1 70.94,82.32 69.57,83.69 69.57,87.81 68.2,89.18 67.74,89.18 U2.7 | P4.4 96.35,70.12 86.55,79.92 83.16,83.31 77.9,83.31 v77.9,83.29
  Bottom 0.254: v72.54,82.09 76.71,82.09 v77.9,83.29
1SDA  (via drill 0.33)
  Top 0.254: P4.3 95.7,61.1 95.25,61.55 95.25,66.4 79.55,82.09 75.74,82.09 R15.1 75.51,82.32 74.83,83.01 v74.37,83.01 | v66.6,88.49 67.51,88.49 U2.6
  Bottom 0.254: v66.6,88.49 68,88.49 73.48,83.01 v74.37,83.01
2SCL  (via drill 0.33)
  Top 0.254: v72.31,86.21 71.17,86.21 R9.1 | v72.85,88.75 70,88.75 68.2,90.55 67.74,90.55 U2.9 | v81.97,85.78 86.46,85.78 87.14,85.1 96.03,85.1 96.35,85.43 P3.4
  Bottom 0.254: v72.31,86.21 72.85,86.74 v72.85,88.75 | v72.85,88.75 | v72.85,88.75 78.99,88.75 v81.97,85.78
2SDA
  Top 0.254: P3.3 95.7,86.16 94.87,87 75.56,87 | U2.8 67.74,89.87 68.2,89.87 70.03,88.04 70.03,87.58 70.61,87 75.56,87 | R10.1 75.56,87
3.3V  (via drill 0.33)
  Top 0.254: R46.2 24.77,35.69 25.68,34.77 25.68,33.4 23.85,31.57 22.25,31.57 21.79,31.12 21.79,29.74 21.57,29.52 20.04,29.52 19.74,29.82 v19.74,30.43 19.74,30.46 19.25,30.94 19.25,32.97 18.82,33.4 C27.1 | v18.59,36.6 18.59,42.32 18.82,42.55 19.89,42.55 19.91,42.44 U7.24 | R50.1 17.77,30.62 | 31.39,22.89 D3.A | 29.34,22.89 TP4.1 | U1.13 15.62,105.41 15.62,106.32 15.39,106.55 12.65,106.55 12.42,106.32 12.42,104.5 14.25,102.67 14.71,102.67 C5.1 14.94,102.44 15.62,101.75 v16.08,101.75 | v17.91,101.75 18.59,102.44 19.05,102.44 C6.1 | R23.2 34.59,74.55 31.85,74.55 R22.2 30.75,74.56 29.79,73.61 29.79,67.46 27.74,65.41 RPI3B+.17 | 64.08,87.81 64.08,93.98 C9.1 | 64.08,87.81 64.08,86.89 62.48,85.29 62.03,85.29 U2.24 | C7.1 68.66,99.92 69.57,99.01 69.57,96.77 72.08,94.26 72.08,92.84 71.17,91.92 R4.2 70.94,91.92 70.26,91.92 v69.8,92.38 | 73.46,84.38 75.51,84.38 R10.2 | 73.46,84.38 71.17,84.38 R9.2 | R19.1 68.2,76.61 70.94,76.61 R20.2 71.17,76.61 v72.31,76.61 | 73.46,80.49 75.51,80.49 R15.2 | 73.46,80.49 73.41,80.49 | 73.41,80.49 71.17,80.49 R14.2 | 73.41,80.49 73.41,78.72 v73.91,78.21 75.51,76.61 R21.2 | 73.46,80.49 73.46,84.38 | v65.79,87.81 64.08,87.81 | 71.17,88.04 R6.2 | 75.51,88.04 R7.2 75.61,87.96 | 73.91,91.24 74.37,91.69 75.51,91.69 R5.2 | 97,32.85 95.58,32.85 | P5.6 95.58,32.85 | P1.8 94.22,109.53 | 95.58,108.91 95.63,108.85 | 95.58,32.85 94.35,32.85 | 94.35,32.85 C29.1 | 94.35,32.85 94.28,32.85 P5.8
  Top 0.305: C7.1 68,99.39 P2.6 66.36,99.39 66.04,99.06 66.04,98.59 66.52,98.11 66.8,98.11 P2.8 | P4.8 94.4,56.97 C20.1 94.77,56.9 95.73,55.94 96.82,55.94 97.03,56.15 97.03,58.09 | 97.03,58.09 95.89,58.09 95.7,58.28 P4.6 | 97.03,58.09 98.15,58.09 | P3.6 95.7,83.51 | 95.7,83.51 98.09,83.51 98.15,83.57 | C4.1 94.35,108.85 | 94.22,109.53 94.22,108.85 94.35,108.85 | 94.35,108.85 95.63,108.85 | P1.6 95.58,108.91 | C13.1 94.35,83.51 | 94.35,83.51 95.7,83.51 | P3.8 94.4,83.56 94.35,83.51 | R35.1 81.28,60.59 81.28,61.85 82.04,62.61 82.04,64.14 71.12,75.06 R20.2
  Top 0.508: 97,32.85 98.15,33.99 98.15,58.09 98.15,83.57 98.15,86.11 | 75.51,88.04 73.91,88.04 | 73.91,88.04 71.17,88.04 | 73.91,88.04 73.91,91.24 v73.69,91.47 | 75.61,87.96 96.29,87.96 98.15,86.11 | v20.27,44.02 21.67,45.42 21.67,50.06 22.5,50.9 22.5,62.51 24.26,64.26 26.42,64.26 27.51,65.36 RPI3B+.17 | v19.74,30.43 17.96,30.43 17.77,30.62 | 95.63,108.85 97.14,108.85 98.15,107.85 98.15,86.11
  Top 0.61: 29.34,22.89 31.39,22.89
  Bottom 0.254: 27.99,69.27 27.91,69.34 | 27.74,65.63 RPI3B+.17 | v65.79,87.81 65.79,87.86
  Bottom 0.508: 20.21,30.9 28.3,22.8 28.32,22.86 TP4.1 | 20.21,30.9 18.47,32.64 18.47,36.47 v18.59,36.6 18.47,36.73 18.47,42.19 20.27,43.99 v20.27,44.02 | 20.21,30.9 v19.74,30.43 | v16.08,101.75 v17.91,101.75 17.91,75.39 23.95,69.34 27.91,69.34 | 29.26,69.27 29.26,67.16 27.74,65.63 | v72.31,76.61 72.31,78 72.52,78.21 v73.91,78.21 72.39,78.21 65.28,85.32 65.28,87.3 v65.79,87.81 65.41,88.19 65.41,89.08 68.71,92.38 v69.8,92.38 72.77,92.38 v73.69,91.47 | 29.26,69.27 33.73,69.27 52.32,87.86 65.79,87.86 | 29.26,69.27 27.99,69.27
3.3V-LED-R
  Top 0.254: 37.11,22.89 R55.2 | 34.59,22.89 D3.C
  Top 0.61: 34.59,22.89 37.11,22.89
3SCL
  Top 0.254: P1.4 96.22,111.15 96.22,111.46 95.1,112.57 93.17,112.57 78.87,98.27 78.87,95.28 76.2,92.61 73.69,92.61 70.94,89.87 R6.1 71.17,89.87 69.24,91.8 67.72,91.8 U2.11
3SDA  (via drill 0.33)
  Top 0.254: P1.3 95.58,111.39 95.19,111.77 93.54,111.77 91.69,109.92 91.69,99.64 81.92,89.87 75.74,89.87 R7.1 75.51,89.87 v74.6,90.78 | v69.11,90.78 68.66,91.24 67.74,91.24 U2.10
  Bottom 0.254: v74.6,90.78 v69.11,90.78
4.096V  (via drill 0.33)
  Top 0.254: v12.88,77.98 12.88,77.72 13.11,77.5 13.11,77.06 U3.2 | v16.99,109.75 16.99,111.12 U1.2
  Top 0.305: U1.2 16.94,113.35 C3.1 C2.1
  Bottom 0.254: v12.88,77.98 12.88,90.37 11.94,91.31 11.94,93.34 12.88,94.36 12.88,109.27 13.97,110.36 16.38,110.36 v16.99,109.75
4SCL
  Top 0.254: 62.71,96.04 62.71,92.15 62.48,91.92 62.03,91.92 U2.14 | 62.71,96.04 62.71,97.87 64.77,99.92 65.23,99.92 P2.4 | 62.71,96.04 66.6,96.04 68.89,93.75 70.94,93.75 R4.1
4SDA
  Top 0.254: 65.91,100.38 65.91,99.7 65.68,99.47 65.46,99.47 P2.3 | 65.91,100.38 65.68,100.61 64.77,100.61 62.03,97.87 62.03,92.61 U2.13 | R5.1 74.56,93.61 70.03,98.15 70.03,100.15 69.47,100.71 66.24,100.71 65.91,100.38
5V
  Top 0.152: R59.2 35.43,42.42 35.43,39.5
  Top 0.254: 31.39,27.92 D2.A | 29.34,27.92 TP2.1
  Top 0.508: 36.32,48.9 36.07,49.15 36.07,57.4 44.76,66.1 45.85,66.1 46.23,66.48 46.23,69.09 46.61,69.47 56.39,69.47 R28.2 C15.1
  Top 0.61: 29.34,27.92 31.39,27.92
  Top 1.27: C24.1 C23.1 | 36.32,48.9 36.32,49.4 35.43,48.51 35.43,39.5 J7.2
  Bottom 1.016: J7.2 35.81,39.12 35.81,35.69 33.02,32.89 28.7,32.89 27.05,31.24 27.05,29.34 28.45,27.94 TP2.1
  pour Top (no thermals): 35.56,39.37 35.56,48.39 36.83,49.66 51.56,49.66 51.56,46.1 42.29,46.1
5V-LED-R
  Top 0.254: 37.11,28.14 R53.2 | 34.59,28.14 D2.C
  Top 0.61: 34.59,28.14 37.11,28.14
5VREG-EN
  Top 0.508: R26.2 59.7,65.53 55.5,65.53 55.25,65.28 U4.1
5VREG-PG
  Top 0.508: R32.1 48.37,63.48 U4.4
5VREG-SW
  Top 0.508: U4.6 52.7,55.25 | L1.1 51.28,53.83 52.7,55.25 | 52.7,55.25 53.34,54.61 C21.2
  pour Top (isolate 0, no thermals): 51.82,59.06 53.47,59.06 53.47,56.13 53.47,54.23 53.34,54.1 51.94,52.71 49.15,52.71 48.26,52.71 47.88,53.09 47.88,55.12 48.01,55.25 51.44,55.25 51.82,55.63
5VREG-VBST
  Top 0.508: C21.1 55.51,54.74 53.98,56.27 U4.7
5VREG-VFB
  Top 0.254: 53.98,66.55 53.86,66.66
  Top 0.508: R27.1 53.86,66.66 R28.1 57.78,68.06 57.78,70.88 C15.2 | U4.2 53.98,66.55
5VREG-VREG
  Top 0.508: U4.3 52.7,64.77 52.45,65.02 47.62,65.02 C16.1 R32.2
11LX
  Top 0.254: J10.3 6.09,10.72 R57.1 6.09,12.31 6.6,12.83 9.65,12.83 9.91,12.57 9.91,9.93 U9.7
11LY
  Top 0.254: J10.4 3.83,3.52 R58.1 5.83,1.52 8.64,1.52 9.78,2.67 U9.2
11SCL  (via drill 0.33, 0.35)
  Top 0.254: v12.88,37.97 13.21,38.3 13.82,38.3 14.1,38.54 U7.7 | v12.88,42.55 14.02,43.69 15.01,43.69 18.21,46.89 20.19,46.89 R43.1 | U9.3 11.05,3.18 v11.81,2.41
  Bottom 0.254: v12.88,42.55 12.62,42.29 12.62,38.23 v12.88,37.97 12.88,29.59 12.88,29.29 9.12,25.53 9.12,4.22 10.92,2.41 v11.81,2.41
11SDA  (via drill 0.33, 0.35)
  Top 0.254: v13.56,39.12 14.48,39.12 U7.6 | v13.56,44.37 16.08,46.89 R42.1 | v11.81,13.34 11.81,10.95 11.05,10.19 U9.6
  Bottom 0.254: v13.56,44.37 13.82,44.12 13.82,39.37 v13.56,39.12 13.82,38.86 13.82,28.78 9.96,24.92 9.96,15.19 v11.81,13.34
12V  (via drill 0.33, 0.35)
  Top 0.254: v11.28,82.55 14.71,79.12 R16.1
  Top 0.508: v60.58,69.85 60.58,68.97 R26.1
  Top 0.61: J4.1 7.82,82.55 13.77,88.49 15.77,88.49 15.88,88.39 20.24,88.36 21.36,89.48 21.36,92.73 23.5,94.87 43.76,94.87 v68.66,69.98 | D1.A 29.34,30.35 TP1.1
  Top 2.54: J11.PWR 66.24,27.47 66.24,43.68 60.9,49.02 60.9,49.15 C25.+
  Bottom 0.254: 3.96,110.67 J2.1 4.19,110.49 | 3.96,124.38 J1.1 | J3.1 4.6,96.52 | 68.43,25.17 J11.PWR | 65.02,69.85 64.77,69.85
  Bottom 0.61: 3.96,110.67 3.96,112.06 6.58,114.68 6.58,121.77 3.96,124.38 | J4.1 6.71,82.55 | 6.71,82.55 v11.28,82.55 | 4.6,96.52 6.71,94.41 6.71,82.55 | 4.19,110.49 6.2,108.48 6.2,97.56 5.16,96.52 J3.1
  Bottom 1.016: TP1.1 34.67,30.48 38.96,34.77 38.96,38.96 43.81,43.82 57.84,43.82 68.43,33.22 | 68.43,25.17 68.43,33.22 | v68.66,69.98 68.53,69.85 65.02,69.85 | v60.58,69.85 64.77,69.85 64.77,62.23 68.43,58.57 68.43,33.22
  pour Top (isolate 0, no thermals): 56.01,59.06 54.36,59.06 54.36,56.13 55.25,55.25 56.01,55.25 56.52,54.74 56.52,49.66 58.29,47.88 62.36,47.88 62.86,48.39 62.86,50.67 59.82,53.72 58.93,53.72 58.55,54.1 58.55,60.2 58.42,60.33 57.28,60.33
12V-LED-R
  Top 0.254: 36.88,30.43 R52.2 | 34.59,30.43 D1.C
  Top 0.61: 34.59,30.43 36.88,30.43
22LX
  Top 0.254: J8.3 6.37,28.79 6.37,31.53 R49.1 6.47,32.12 7.87,33.53 10.92,33.53 U8.7
22LY
  Top 0.254: J8.4 5.85,22.75 R54.1 6.34,22.49 6.86,21.97 9.27,21.97 10.92,23.62 U8.2
22SCL
  Top 0.254: U7.9 12.58,37.24 12.45,37.36 11.56,37.36 8.82,34.62 6.32,34.62 3.72,37.22 2.96,37.22 | 2.96,37.22 1.75,36.02 1.75,21.74 2.67,20.83 9.27,20.83 12.19,23.75 U8.3 | 2.96,37.22 | 2.96,37.22 1.8,38.38 1.8,51.97 2.39,52.55 10.89,52.55 13.59,55.26 13.59,57.66 14.73,58.8 17.14,58.8 17.65,59.31 17.65,60.45 18.14,60.94 20.88,60.94 21.41,60.4 21.41,52.68 20.19,51.46 R40.1
22SDA  (via drill 0.33)
  Top 0.254: U7.8 14.62,37.87 16.1,37.87 v16.13,37.9 16.13,35.31 12.45,31.62 12.45,30.89 U8.6 | v16.08,49.86 16.08,51.23 R41.1
  Bottom 0.254: v16.13,37.9 15.01,39.01 15.01,44.65 16.08,45.72 v16.08,49.86
33LX
  Top 0.254: J5.3 3.83,61.94 6.85,64.95 R30.1 8.37,67.82 10.29,67.82 10.92,67.18 10.92,65.41 10.03,64.52 U5.7
33LY
  Top 0.254: J5.4 5.96,56.18 R39.1 6.1,55.87 6.1,55.37 6.73,54.74 9.53,54.74 10.03,55.25 U5.2
33SCL  (via drill 0.33, 0.35)
  Top 0.254: v3.05,35.92 4.32,35.92 6.22,34.01 11.92,34.01 13.85,35.94 U7.11 | R33.1 12.71,60.19 12.7,60.2 11.3,58.8 U5.3 11.3,55.37 10.03,54.1 2.67,54.1 v2.29,53.72
  Bottom 0.254: v3.05,35.92 3.05,37.29 1.3,39.04 1.3,52.73 v2.29,53.72
33SDA  (via drill 0.33, 0.35)
  Top 0.254: v12.19,36.6 14.48,36.6 U7.10 | v12.19,49.78 12.19,52.07 14.22,54.1 14.22,57.23 15.39,58.4 18.09,58.4 19.84,60.15 20.19,60.15 R34.1 | v13.97,62.23 12.19,62.23 11.3,63.12 U5.6
  Bottom 0.254: v12.19,36.6 v12.19,49.78 12.19,60.45 v13.97,62.23
A0_PC
  Top 0.254: U2.1 67.51,85.29 67.06,85.29 65.23,83.46 R13.1
A1_PC
  Top 0.254: U2.2 67.51,85.98 66.14,85.98 64.08,83.92 64.08,78.44 R18.1
A2_PC
  Top 0.254: U2.21 61.8,87.35 59.66,87.35 59.28,86.97 59.28,84.15 59.97,83.46 60.66,83.46 R12.1
A3_PC
  Top 0.254: U7.1 14.62,42.42 15.29,42.42 17.91,39.8 17.91,36.14 19.28,34.77 19.51,34.77 20.88,33.4 20.88,30.66 R51.1
A4_PC
  Top 0.254: U7.2 14.1,41.78 13.69,42.19 13.69,42.67 14.25,43.23 21.57,43.23 22.48,42.32 22.48,39.12 24.99,36.6 26.37,36.6 28.88,34.09 R47.1
A5_PC
  Top 0.254: U7.21 20.65,40.49 21.11,40.49 22.02,39.57 22.02,36.6 24.54,34.09 R46.1
ADC1
  Top 0.254: R8.2 14.71,87.58 11.96,84.84 11.73,84.84 10.14,83.24 10.14,77.95 9,76.82 7.24,76.82 5.97,75.55 J4.3
ADC2
  Top 0.254: R3.2 14.44,93.9 8.23,93.9 3.96,89.64 J3.3
ADC3
  Top 0.254: R2.2 14.71,97.64 9.68,97.64 3.96,103.35 J2.3
ADC4
  Top 0.254: R1.2 14.06,120.29 12.78,120.29 6.21,117.46 J1.3
ADC-12V-SENSE
  Top 0.254: R11.1 14.94,83.24 14.94,80.95 R16.2 14.94,80.72 16.54,79.12 19.28,79.12 R17.1
ADC-DIN  (via drill 0.33)
  Top 0.254: v20.88,68.15 20.88,66.55 R29.2 | v16.31,106.78 16.31,105.41 U1.14
  Bottom 0.254: v20.88,68.15 20.5,68.15 14.68,73.97 14.68,103.76 16.31,105.39 v16.31,106.78
ADC-DOUT  (via drill 0.33)
  Top 0.254: v22.02,69.52 21.11,69.52 R25.2 | v16.54,104.04 16.99,104.5 16.99,105.18 U1.15
  Bottom 0.254: v22.02,69.52 21.84,69.52 15.14,76.23 15.14,102.9 16.28,104.04 v16.54,104.04
ADC-IN0
  Top 0.254: 19.05,89.41 14.94,89.41 R8.1 | 19.05,89.41 19.18,89.41 20.7,90.93 20.7,100.53 20.3,100.94 20.3,105.08 17.45,107.93 16.99,107.93 15.62,109.3 15.62,111.12 U1.4 | 19.05,89.41 C11.1
ADC-IN1  (via drill 0.33)
  Top 0.254: C10.1 19.05,91.69 14.94,91.69 R3.1 14.71,91.69 v13.56,92.84 | v14.94,109.3 14.94,111.12 U1.5
  Bottom 0.254: v14.94,109.3 14.94,109.27 13.82,108.15 13.82,93.09 v13.56,92.84
ADC-IN2
  Top 0.254: 17.22,95.81 14.94,95.81 R2.1 | 17.22,95.81 19.05,95.81 C8.1 | 17.22,95.81 17.22,102.21 18.36,103.35 18.36,106.32 17.22,107.47 15.62,107.47 14.25,108.84 14.25,109.73 14.34,109.91 U1.6
ADC-IN3
  Top 0.254: R1.1 14.15,122 16.41,122 18.14,120.27 C1.1 18.14,120.04 13.79,115.7 13.79,111.35 U1.7
ADC-IN4
  Top 0.254: C12.1 19.05,83.24 19.28,83.01 19.28,80.95 R17.2 19.51,80.72 20.42,79.81 20.42,76.61 19.96,76.15 7.39,76.15 5.11,73.86 3.28,73.86 2.06,75.08 2.06,103.96 3.28,105.18 4.19,105.18 10.14,111.12 12.88,111.12 U1.8
ADC-SCLK  (via drill 0.33)
  Top 0.254: v20.88,74.09 20.88,72.49 R24.2 | v17.68,104.04 17.68,105.18 U1.16
  Bottom 0.254: v20.88,74.09 19.08,75.9 19.08,102.64 v17.68,104.04
GND  (via drill 0.35)
  Top 0.254: 39,30.23 38.99,30.23 R52.1 | R47.2 29.58,35.7 30.61,34.67 30.61,33.02 30.1,32.51 28.32,32.51 15.37,19.56 J9.1
  Top 0.406: 53.31,65.18 53.31,60.66
  Top 0.508: C16.2 47.75,68.46 R27.2 49.66,68.46 49.66,66.93 50.8,65.79 52.7,65.79 53.31,65.18 | U4.9 53.34,60.63 53.31,60.66 | 29.72,82.04 26.25,82.04 RPI3B+.30
  Top 0.61: R48.2 38.87,34.54
  Top 1.27: 22.86,16.86 17.55,16.86 J9.1 | 38.87,34.54 38.99,34.42 | 64.52,62.04 62.16,59.69 C18.2
  Top 2.54: J11.GND 65.58,19.13 62.58,22.13 62.58,39.05 57.79,43.84 43.81,43.84 38.99,39.02 38.99,34.42 38.99,30.23 | 22.86,16.86 36.96,16.86 39.02,18.92 39,18.94 R56.1 R55.1 R53.1 39,30.23 | 64.52,62.04 64.52,68.45 58.17,74.8 42.04,74.8 34.8,82.04 29.72,82.04
  other vias: 11.43,39.88 65.66,97.28 66.17,95.38 79.63,92.08 82.04,84.58 52.32,59.82 52.32,61.6 53.34,61.6 54.36,61.6 53.34,59.82 54.36,59.82 56.77,60.96 56.77,61.6 50.16,59.82 50.16,61.6
  pour Top (isolate 0.254, no thermals): 25.4,49.53 22.86,49.53 22.86,95.25 29.21,95.25 29.21,50.8 26.67,50.8
  pour Bottom (isolate 0): -5.08,133.35 116,133.35 arc-45 117.44,132.75 119.38,130.81 119.38,12.7 112.36,5.68 arc-45 110.92,5.08 19.05,5.08 13.97,0 -3.81,0 -3.81,131.24 arc45 -4.41,132.68
  pour Top (isolate 0, rank 3, no thermals): 63.12,43.18 74.93,43.18 74.93,57.15 73.66,58.42 69.85,58.42 69.85,63.5 68.58,64.77 55.88,64.77 55.88,62.23 41.91,62.23 36.83,57.15 36.83,50.8 46.99,50.8 47.5,51.31 47.5,54.99 48.01,55.5 51.44,55.5 51.69,55.75 51.69,59.18 55.75,59.18 57.02,60.45 58.42,60.45 59.18,59.69 59.18,54.74 63.12,50.8
  pour Top (isolate 0, rank 2, no thermals): -3.81,130.81 24.13,130.81 24.13,5.08 19.05,0 -2.54,0 -5.08,2.54 -5.08,129.54
  pour Top (isolate 0, no thermals): 57.66,101.6 57.66,72.39 59.56,70.48 65.41,70.48 74.93,60.96 74.93,16.51 111.76,16.51 114.3,19.05 114.3,125.73 78.74,125.73 77.47,124.46 77.47,101.6
GND1  (via drill 0.35)
  Top 0.61: 34.29,35.7 v34.29,36.7
  Top 0.635: R48.1 34.29,35.7
  Bottom 1.016: v34.29,36.7 29.84,36.7 RPI3B+.41
GPIO12
  Top 0.254: RPI3B+.32 26.24,84.57 36.36,84.57 43.66,77.27 58.16,77.27 69.46,65.97 69.46,64.14 70.86,62.74 R36.2
PI5V-LED-R
  Top 0.254: 37.11,20.37 R56.2 | 34.59,20.37 D4.C
  Top 0.61: 34.59,20.37 37.11,20.37
PI_5V_POWER  (via drill 0.35)
  Top 0.152: R59.1 33.02,42.03 J7.1
  Top 0.254: 32.83,20.37 31.62,20.37 D4.A | 21.01,83.06 21.01,83.11 19.74,84.38 11.96,84.38 10.59,83.01 10.59,81.41 14.94,77.06 U3.1
  Top 0.305: 29.82,44.24 29.61,44.45 28.45,44.45 28,44.01 26.16,44.01 RPI3B+.2 | U3.1 15.07,76.97 C14.1 | RPI3B+.4 24.97,47.6
  Top 0.406: Q2.2 77.23,60.72 v76.33,59.82 | v22.35,76.84 21.01,78.18 21.01,83.06 | v57.02,78.87
  Top 0.61: 30.48,45.72 30.48,66.29 31.24,67.06 | v44.96,67.06 31.24,67.06 | 31.24,67.06 30.48,67.82 30.48,73.15 30.99,73.66 35.69,73.66 36.07,74.04 36.07,75.56 35.31,76.33 32.89,76.33 v30.48,78.74 | R31.2 v76.2,64.77 | v57.02,78.87 57.53,78.87 70.1,66.29 v70.1,65.02
  Top 1.016: J7.1 33.02,36.43 32.02,35.44 32.02,33.65 32.83,32.84 32.83,20.37 32.83,20.32 TP5.1 21.64,20.32 J9.2
  Top 2.032: 24.97,47.6 RPI3B+.2
  Top 2.286: J7.1 31.75,40.64
  Top 2.54: 31.75,40.64 31.75,44.45 30.48,45.72 29.82,45.72 29.82,44.24
  Bottom 0.406: v30.48,78.74 28.66,76.93 24.45,76.93 24.37,76.84 v22.35,76.84
  Bottom 0.61: v76.33,59.82 76.33,64.64 v76.2,64.77 75.95,65.02 v70.1,65.02 | v44.96,67.06 44.96,67.18 56.64,78.87 v57.02,78.87
  pour Top (isolate 0): 22.86,48.9 22.86,43.18 30.48,43.18 30.48,49.53 26.67,49.53 25.91,48.77 23.62,48.77 23.17,48.77 arc-45
RESET  (via drill 0.33)
  Top 0.203: 16.08,30.66 17.78,32.36 17.78,34.54 17.53,34.8 17.53,39.37 16.64,40.26 v16.08,40.26
  Top 0.254: U2.3 67.74,86.67 68.2,86.67 68.66,86.21 68.66,78.89 68.2,78.44 R19.2 68.2,78.21 v65.68,78.21 | v16.08,40.26 15.16,41.17 14.71,41.17 U7.3 | R50.2 16.08,30.66
  Bottom 0.254: v16.08,40.26 16.08,41.61 19.56,45.09 23.14,45.09 24.18,44.04 29.06,44.04 63.2,78.18 65.68,78.18 v65.68,78.21
SCL  (via drill 0.33)
  Top 0.254: v21.79,41.86 21.11,41.17 20.65,41.17 U7.22 | v22.71,43.92 22.71,44.37 23.16,44.83 23.16,46.89 v23.39,47.12 | v59.97,86.67 61.8,86.67 U2.22 | v36.3,68.28 31.85,72.72 R22.1
  Bottom 0.254: v21.79,41.86 21.79,43 v22.71,43.92 | v59.97,86.67 54.74,86.67 36.32,68.25 | 36.32,68.25 36.32,64.69 30.79,59.16 30.79,53.24 27.89,50.34 RPI3B+.5 | 36.32,68.25 | 36.32,68.25 v36.3,68.28
  Bottom 0.305: v23.39,47.12 23.78,47.5 23.78,48.23 24.63,49.09 25.46,49.09 26.66,50.28 RPI3B+.5
SDA  (via drill 0.33, 0.35)
  Top 0.254: v19.28,41.86 20.42,41.86 U7.23 | v21.79,44.37 22.02,44.37 22.71,45.06 v22.71,48.03 | v59.97,84.61 61.34,85.98 61.8,85.98 U2.23 | v39.01,68.53 34.82,72.72 R23.1
  Top 0.305: v31.75,60.96 v33.03,59.68
  Bottom 0.254: v21.79,44.37 v19.28,41.86 | v59.97,84.61 59.97,83.92 41.91,65.86 | RPI3B+.3 27.74,47.8 33.4,53.47 33.4,57.35 34.38,58.33 41.91,65.86 | v39.01,68.53 41.68,65.86 41.91,65.86
  Bottom 0.305: v22.71,48.03 23.78,49.1 23.78,51.03 24.25,51.5 28.24,51.5 30.1,53.36 30.1,59.31 v31.75,60.96 | v33.03,59.68 34.38,58.33
SENS_POWER  (via drill 0.35)
  Top 0.254: 17.6,54.18 19.94,54.18 20.19,53.92 R40.2 | 17.6,54.18 16.31,54.18 16.13,54 R41.2 | 17.6,55.65 16.31,56.95 16.31,57.4 R37.2 | 17.6,54.18 17.6,55.65 | R38.2 18.8,57.42 17.6,56.22 17.6,55.65 | 17.6,48.91 20.32,48.91 R43.2 20.32,49.67 21.84,51.19 21.84,60.93 20.92,61.85 20.33,61.85 R34.2 | 17.6,48.91 R42.2 | R58.2 6.36,2.79 6.36,6.73 | 6.36,6.73 6.36,9.02 7.89,10.54 R57.2 7.89,10.94 8.51,10.31 U9.8 8.64,9.93 8.64,10.43 9.18,10.97 C30.1 | C28.1 9.89,32.39 9.03,32.39 R49.2 | R54.2 7.62,23.76 7.62,24.51 | R49.2 7.62,30.98 7.62,24.51 | J8.1 2.29,31.7 2.29,25.02 2.79,24.51 7.62,24.51 | J10.1 1.78,13.41 1.78,7.87 2.92,6.73 6.36,6.73 | R45.2 7.76,36.96 6.73,37.98 6.73,42.16 | 6.73,42.16 6.73,43.59 U6.8 7.75,46.98 R44.2 C26.1 | J6.1 3.78,51.03 2.29,49.53 2.29,42.93 3.05,42.16 6.73,42.16 | R39.2 7.62,56.15 7.62,60.07 | 7.62,60.07 7.62,63.25 8.28,63.91 U5.8 8.76,66.18 R30.2 C17.1 | J5.1 1.91,66.88 1.91,60.96 2.79,60.07 7.62,60.07 | 17.6,54.18 17.6,48.91 | R49.2 9.26,30.63 U8.8
  Top 0.406: Q2.3 70.06,69.22 68.34,69.22 53.74,83.82 v40.64,83.82 | 18.29,61.99 18.13,62.15
  Top 0.508: v21.59,74.93 20.83,74.93 19.43,73.53 18.48,73.53 18.13,73.19 | 18.13,73.19 15.25,70.31 5.33,70.31 J5.1 | R34.2 18.29,61.99 R33.2 | 18.13,62.15 18.13,73.19
  Bottom 0.406: v40.64,83.82 30.48,83.82 28.66,82.01 26.99,82.01 26.27,81.28 26.27,80.3 25.44,79.47 22.89,79.47 21.21,77.78 21.21,75.31 v21.59,74.93
  Bottom 1.016: J10.1 1.78,17.52 1.78,31.5 3.53,33.25 J8.1 6.6,36.02 6.6,49.53 | 6.6,49.53 5.11,51.03 J6.1 | J5.1 6.6,66.04 6.6,49.53
SENS_POWER_BASE
  Top 0.254: Q1.1 80.33,59.74 | 80.33,59.74 R35.2 | 80.33,59.74 77.22,59.74 76.61,59.13 76.04,59.13 75.87,59.31 R36.1
SENS_POWER_GATE
  Top 0.254: R31.1 79.84,64.77 81.2,63.42 | 81.2,63.42 Q1.3 | Q2.1 75.71,60.72 78.4,63.42 81.2,63.42
SPI_MISO
  Top 0.254: R25.1 19.28,69.52 20.19,70.43 22.48,70.43 23.62,69.29 26.14,69.29 27.51,70.66 RPI3B+.21
SPI_MOSI
  Top 0.254: R29.1 19.17,66.43 20.07,65.53 21.64,65.53 22.89,66.78 26.21,66.78 27.36,67.92 27.51,67.92 RPI3B+.19
SPI_SCLK
  Top 0.254: R24.1 19.41,72.39 20.45,71.35 21.77,71.35 22.23,71.81 26.14,71.81 27.51,73.18 RPI3B+.23

### Text on the board
tPlace: 12V | GND | ADC4 | 4 | 12V | 4 | GND | ADC128 / S102 | ADC3 | 3 | 12V | GND | ADC2 | 2 | Airflow and Pressure Sensor / PI Hat / Project Tetra / Thomas Hudson et al. / 11JAN2021 / v0.00.007 | PCA9548 | 3 | 12V | GND | ADC1 | 1 | Mass Airflow Sensors #1-4 | 2 | 4 | PCA9548 | 3 | 12V | 1 | 5V | DISPLAY | GND | GND | 5V | 3V | RPI / 5V | 2 | 1
bPlace: 5V | GND | SCL | SDA | 5V | Sensirion Sensors #1-4 | GND | SCL | SDA | 5V | GND | SCL | SDA | 5V | GND | SCL | SDA